# EAGLE design CN-Cape006-via08 (EAGLE 7.5.0)

## Sheet 1 of 5: Spannungsversorgung
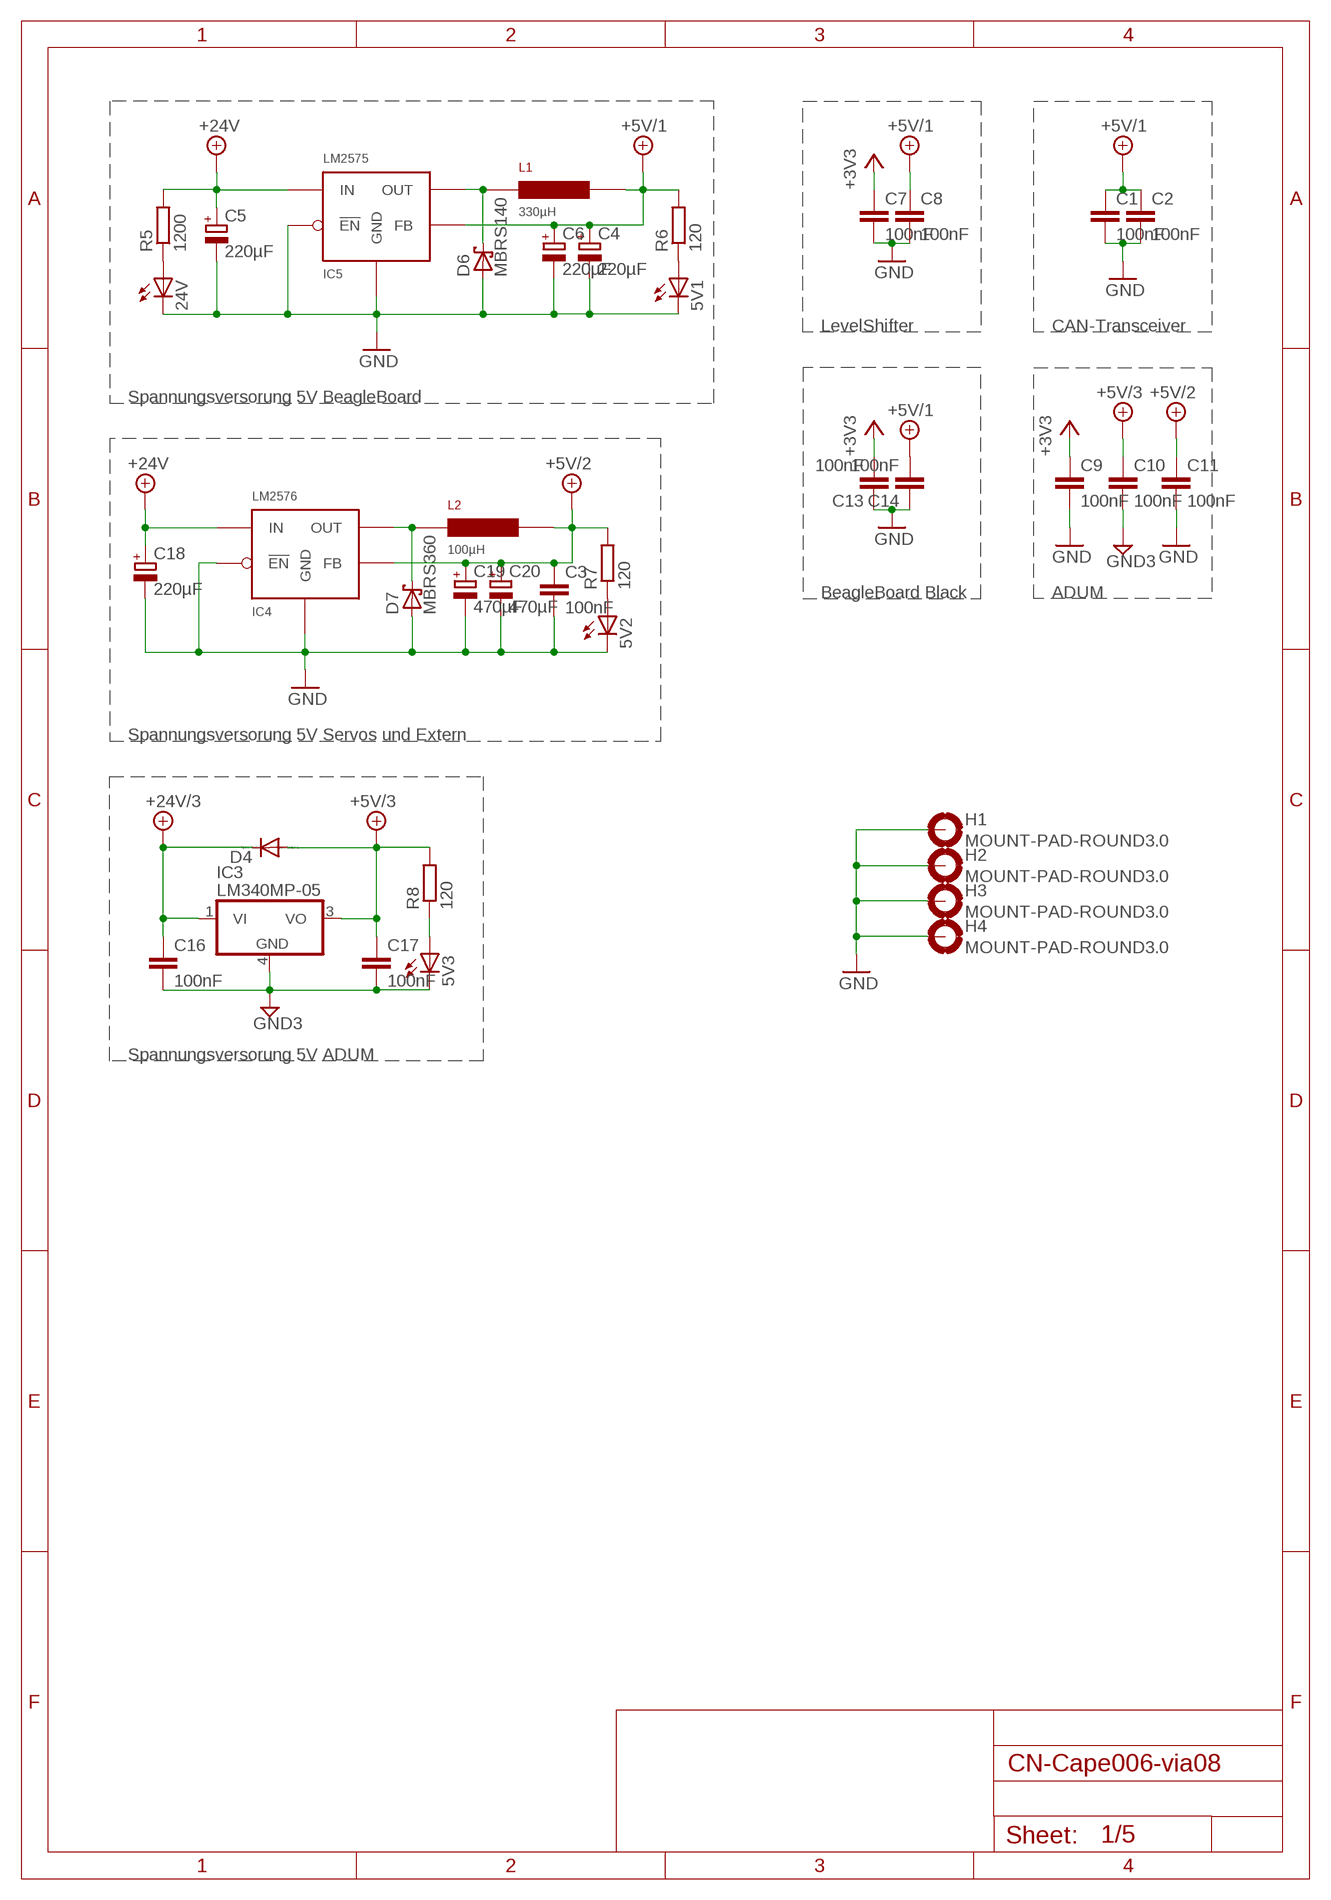
[diagram p0: schematic, sheet 1]

### Parts
5V1  LEDCHIP-LED0603  [CHIP-LED0603]
5V2  LEDCHIP-LED0603  [CHIP-LED0603]
5V3  LEDCHIP-LED0603  [CHIP-LED0603]
24V  LEDCHIP-LED0603  [CHIP-LED0603]
C1  100nF  C-EUC0603  [C0603]
C2  100nF  C-EUC0603  [C0603]
C3  100nF  C-EUC0603  [C0603]
C4  220µF  CPOL-EUE2.5-6  [E2,5-6]
C5  220µF  CPOL-EUE3.5-8  [E3,5-8]
C6  220µF  CPOL-EUE2.5-6  [E2,5-6]
C7  100nF  C-EUC0603  [C0603]
C8  100nF  C-EUC0603  [C0603]
C9  100nF  C-EUC0603  [C0603]
C10  100nF  C-EUC0603  [C0603]
C11  100nF  C-EUC0603  [C0603]
C13  100nF  C-EUC0603  [C0603]
C14  100nF  C-EUC0603  [C0603]
C16  100nF  C-EUC0603  [C0603]
C17  100nF  C-EUC0603  [C0603]
C18  220µF  CPOL-EUE3.5-8  [E3,5-8]
C19  470µF  CPOL-EUE3.5-8  [E3,5-8]
C20  470µF  CPOL-EUE3.5-8  [E3,5-8]
D4  DIODE-SOD123  [SOD123]
D6  MBRS140  MBRS130LT3  [SMB]
D7  MBRS360  MBRS340T3  [SMC]
H1  MOUNT-PAD-ROUND3.0  [3,0-PAD]
H2  MOUNT-PAD-ROUND3.0  [3,0-PAD]
H3  MOUNT-PAD-ROUND3.0  [3,0-PAD]
H4  MOUNT-PAD-ROUND3.0  [3,0-PAD]
IC3  LM340MP-05  [SOT223]
IC4  LM2576  LM2576-T05D  [TO220-5_STAGGERED]
IC5  LM2575  LM2576-T05D  [TO220-5_STAGGERED]
L1  330µH  PISR  [PISR]
L2  100µH  PISR  [PISR]
R5  1200  R-EU_R0805  [R0805]
R6  120  R-EU_R0805  [R0805]
R7  120  R-EU_R0805  [R0805]
R8  120  R-EU_R0805  [R0805]

### Nets
+3V3: C7.1 C9.1 C13.2 ; also sheet 2,3,4,5
+5V/1: C1.1 C2.1 C4.+ C6.+ C8.1 C14.2 IC5.FB L1.P$2 R6.2 ; also sheet 2,3,4
+5V/2: C3.1 C11.1 C19.+ C20.+ IC4.FB L2.P$2 R7.2 ; also sheet 4,5
+5V/3: C10.1 C17.1 D4.A IC3.3(VO) R8.2 ; also sheet 5
+24V: C5.+ C18.+ IC4.IN IC5.IN R5.2 ; also sheet 4
+24V/3: C16.1 D4.C IC3.1(VI) ; also sheet 5
GND: 5V1.C 5V2.C 24V.C C1.2 C2.2 C3.2 C4.- C5.- C6.- C7.2 C8.2 C9.2 C11.2 C13.1 C14.1 C18.- C19.- C20.- D6.A D7.A H1.B3,0(MOUNT) H2.B3,0(MOUNT) H3.B3,0(MOUNT) H4.B3,0(MOUNT) IC4.!EN IC4.GND IC5.!EN IC5.GND ; also sheet 2,3,4,5
GND3: 5V3.C C10.2 C16.2 C17.2 IC3.4(GND) ; also sheet 5
N$6: 24V.A R5.1
N$7: 5V1.A R6.1
N$8: 5V2.A R7.1
N$11: D6.C IC5.OUT L1.P$1
N$12: D7.C IC4.OUT L2.P$1
N$15: 5V3.A R8.1

### Notes on the sheet
- LevelShifter | CAN-Transceiver
- Spannungsversorung 5V BeagleBoard
- BeagleBoard Black | ADUM
- Spannungsversorung 5V Servos und Extern
- Spannungsversorung 5V ADUM

## Sheet 2 of 5: LevelShifter, CAN, LEDs, ADC
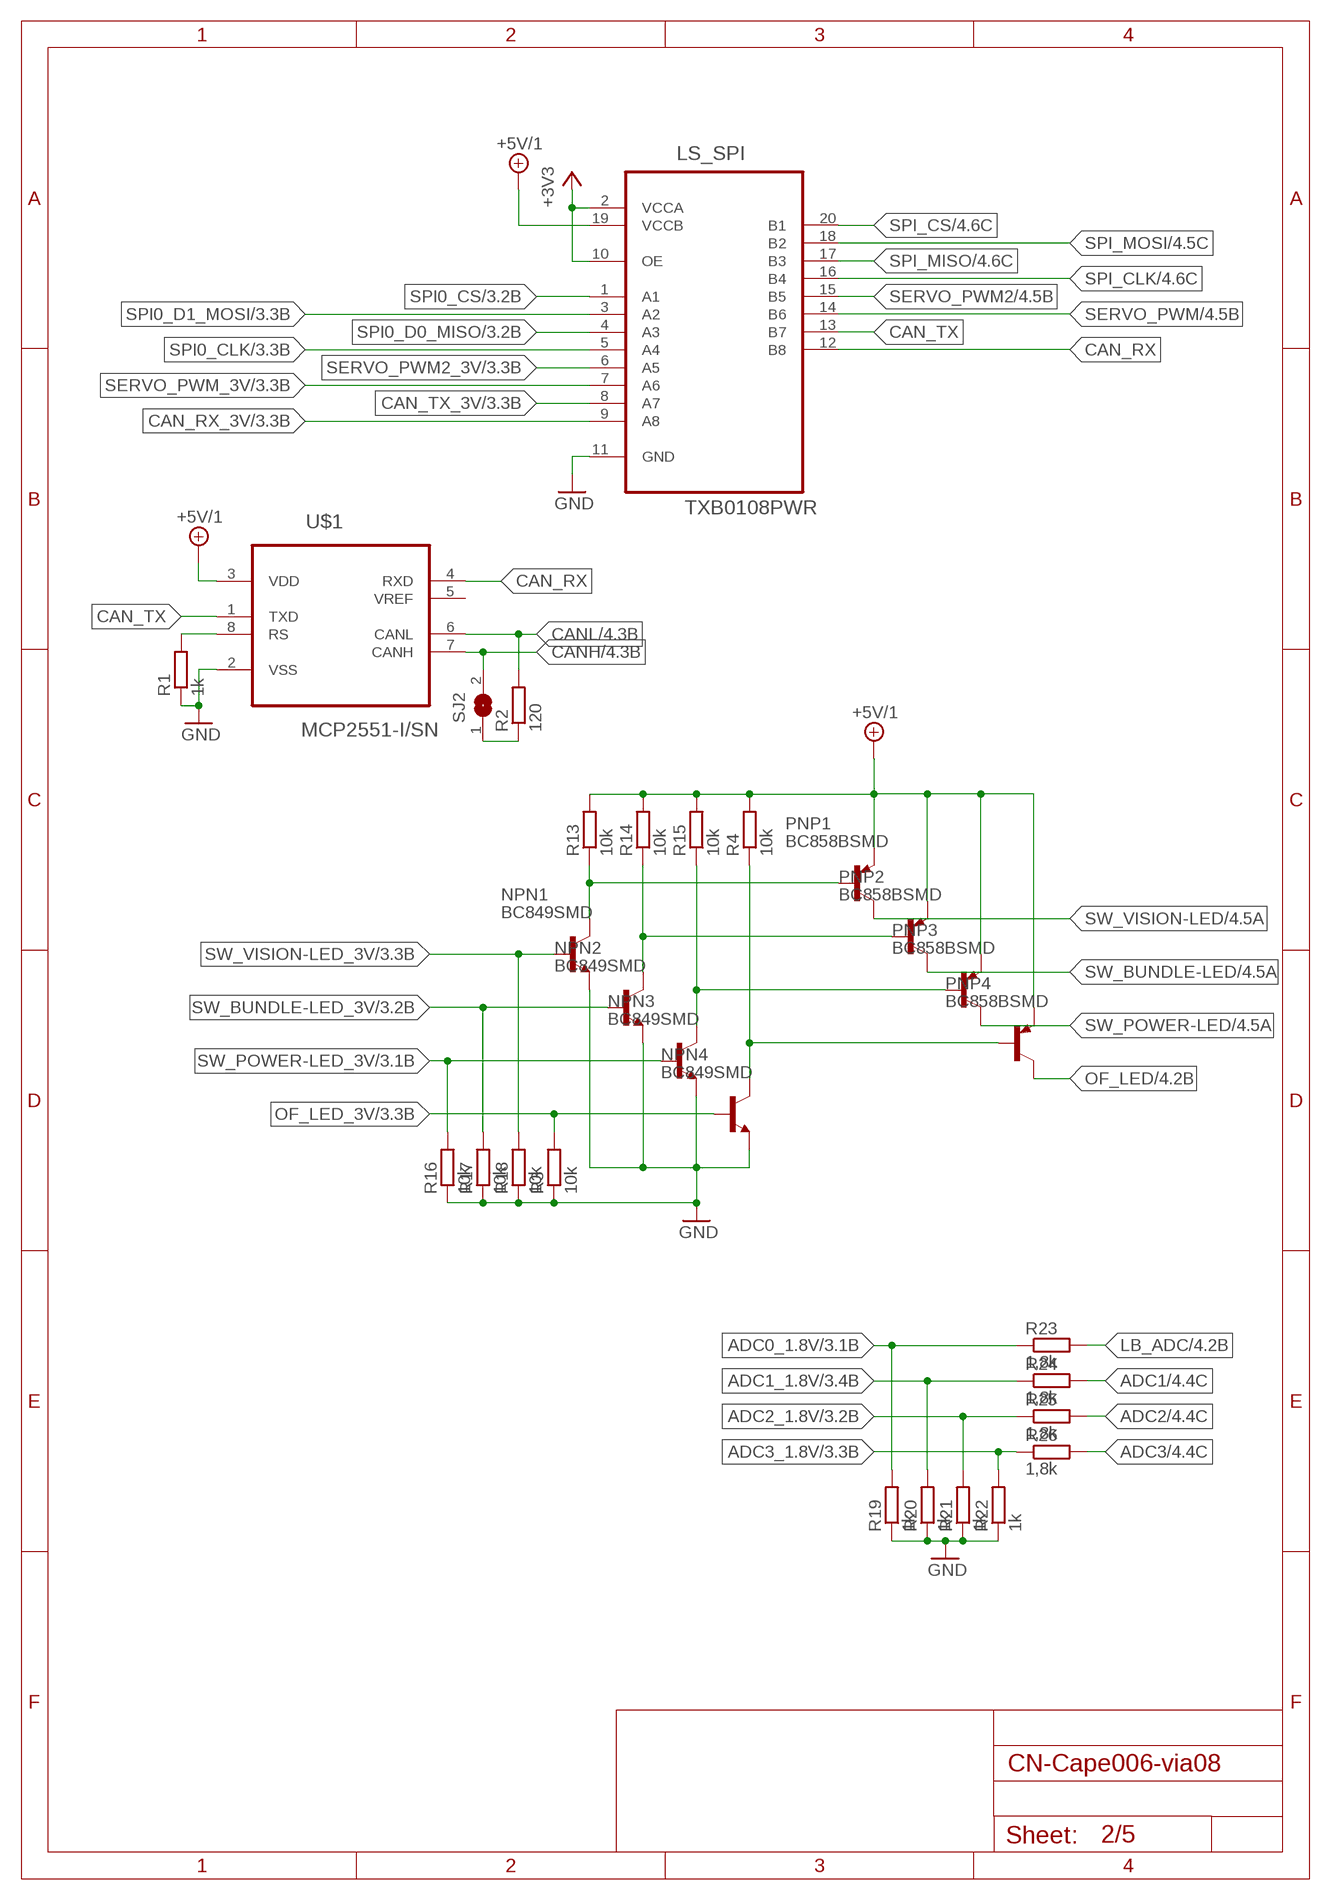
[diagram p1: schematic, sheet 2]

### Parts
LS_SPI  TXB0108PWR  [SOP65P640X120-20N]
NPN1  BC849SMD  [SOT23-BEC]
NPN2  BC849SMD  [SOT23-BEC]
NPN3  BC849SMD  [SOT23-BEC]
NPN4  BC849SMD  [SOT23-BEC]
PNP1  BC858BSMD  [SOT23-BEC]
PNP2  BC858BSMD  [SOT23-BEC]
PNP3  BC858BSMD  [SOT23-BEC]
PNP4  BC858BSMD  [SOT23-BEC]
R1  1k  R-EU_R0805  [R0805]
R2  120  R-EU_R0805  [R0805]
R3  10k  R-EU_R0805  [R0805]
R4  10k  R-EU_R0805  [R0805]
R13  10k  R-EU_R0805  [R0805]
R14  10k  R-EU_R0805  [R0805]
R15  10k  R-EU_R0805  [R0805]
R16  10k  R-EU_R0805  [R0805]
R17  10k  R-EU_R0805  [R0805]
R18  10k  R-EU_R0805  [R0805]
R19  1k  R-EU_R0805  [R0805]
R20  1k  R-EU_R0805  [R0805]
R21  1k  R-EU_R0805  [R0805]
R22  1k  R-EU_R0805  [R0805]
R23  1,8k  R-EU_R0805  [R0805]
R24  1,8k  R-EU_R0805  [R0805]
R25  1,8k  R-EU_R0805  [R0805]
R26  1,8k  R-EU_R0805  [R0805]
SJ2  SJ  [SJ]
U$1  MCP2551-I/SN  [SOIC127P600X175-8N]

### Nets
+3V3: LS_SPI.2(VCCA) LS_SPI.10(OE) ; also sheet 1,3,4,5
+5V/1: LS_SPI.19(VCCB) PNP1.E PNP2.E PNP3.E PNP4.E R4.2 R13.2 R14.2 R15.2 U$1.3(VDD) ; also sheet 1,3,4
ADC0_1.8V: R19.2 R23.1 ; also sheet 3
ADC1: R24.2 ; also sheet 4
ADC1_1.8V: R20.2 R24.1 ; also sheet 3
ADC2: R25.2 ; also sheet 4
ADC2_1.8V: R21.2 R25.1 ; also sheet 3
ADC3: R26.2 ; also sheet 4
ADC3_1.8V: R22.2 R26.1 ; also sheet 3
CAN_RX: LS_SPI.12(B8) U$1.4(RXD)
CAN_RX_3V: LS_SPI.9(A8) ; also sheet 3
CAN_TX: LS_SPI.13(B7) U$1.1(TXD)
CAN_TX_3V: LS_SPI.8(A7) ; also sheet 3
CANH: SJ2.2 U$1.7(CANH) ; also sheet 4
CANL: R2.2 U$1.6(CANL) ; also sheet 4
GND: LS_SPI.11(GND) NPN1.E NPN2.E NPN3.E NPN4.E R1.1 R3.1 R16.1 R17.1 R18.1 R19.1 R20.1 R21.1 R22.1 U$1.2(VSS) ; also sheet 1,3,4,5
LB_ADC: R23.2 ; also sheet 4
N$1: NPN1.C PNP1.B R13.1
N$2: NPN2.C PNP2.B R14.1
N$3: NPN4.C PNP4.B R4.1
N$4: NPN3.C PNP3.B R15.1
N$9: R1.2 U$1.8(RS)
N$10: R2.1 SJ2.1
OF_LED: PNP4.C ; also sheet 4
OF_LED_3V: NPN4.B R3.2 ; also sheet 3
SERVO_PWM: LS_SPI.14(B6) ; also sheet 4
SERVO_PWM2: LS_SPI.15(B5) ; also sheet 4
SERVO_PWM2_3V: LS_SPI.6(A5) ; also sheet 3
SERVO_PWM_3V: LS_SPI.7(A6) ; also sheet 3
SPI0_CLK: LS_SPI.5(A4) ; also sheet 3,4
SPI0_CS: LS_SPI.1(A1) ; also sheet 3
SPI0_D0_MISO: LS_SPI.4(A3) ; also sheet 3,4
SPI0_D1_MOSI: LS_SPI.3(A2) ; also sheet 3,4
SPI_CLK: LS_SPI.16(B4) ; also sheet 4
SPI_CS: LS_SPI.20(B1) ; also sheet 4
SPI_MISO: LS_SPI.17(B3) ; also sheet 4
SPI_MOSI: LS_SPI.18(B2) ; also sheet 4
SW_BUNDLE-LED: PNP2.C ; also sheet 4
SW_BUNDLE-LED_3V: NPN2.B R17.2 ; also sheet 3
SW_POWER-LED: PNP3.C ; also sheet 4
SW_POWER-LED_3V: NPN3.B R16.2 ; also sheet 3
SW_VISION-LED: PNP1.C ; also sheet 4
SW_VISION-LED_3V: NPN1.B R18.2 ; also sheet 3
Unconnected: U$1.5(VREF)

## Sheet 3 of 5: Stecker BeagleBoard Black
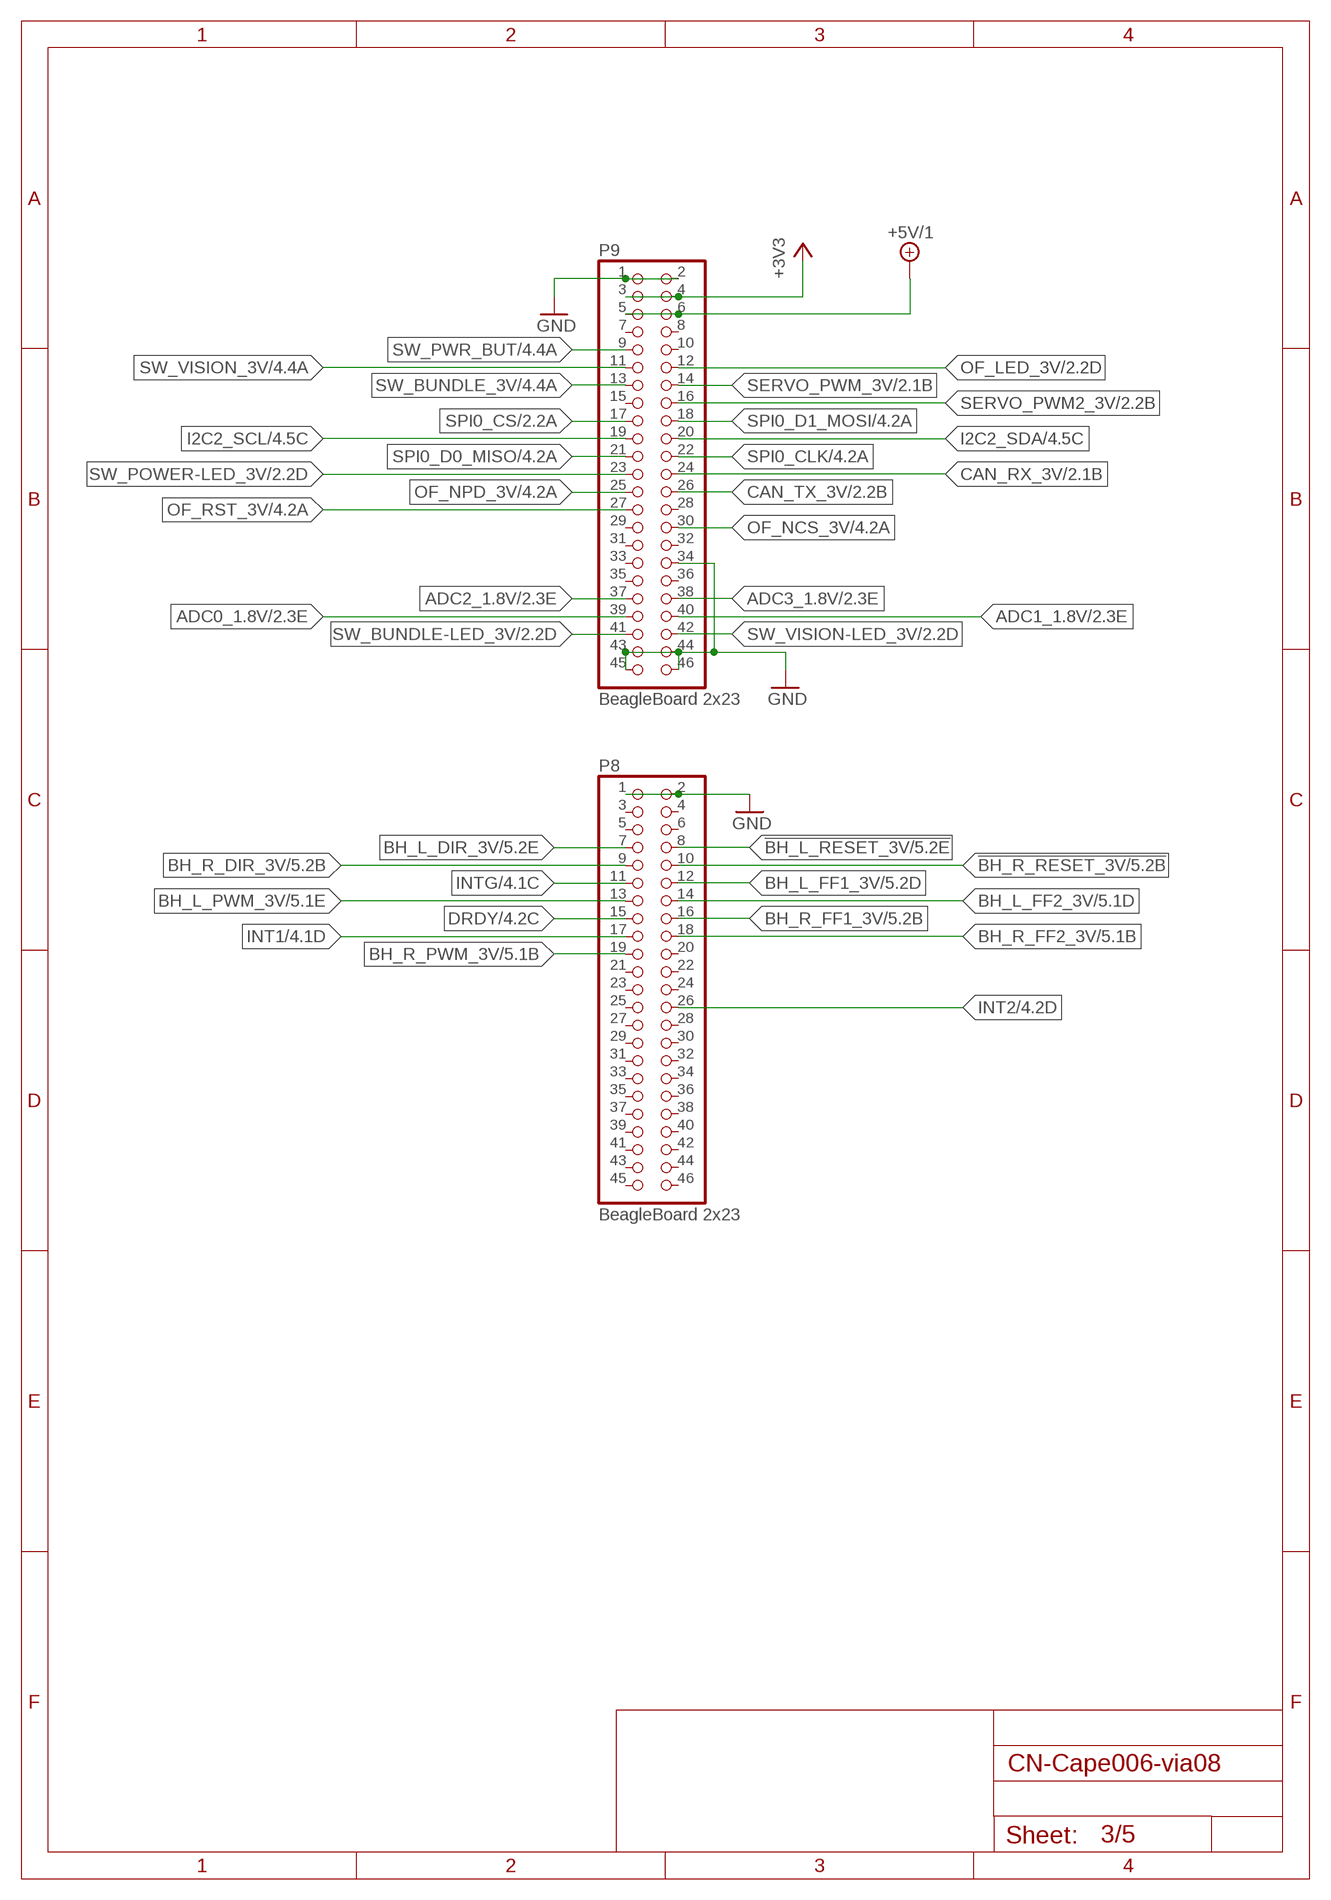
[diagram p2: schematic, sheet 3]

### Parts
P8  BeagleBoard 2x23  PINHD-2X23  [2X23]
P9  BeagleBoard 2x23  PINHD-2X23  [2X23]

### Nets
!BH_L_RESET_3V: P8.8 ; also sheet 5
!BH_R_RESET_3V: P8.10 ; also sheet 5
+3V3: P9.3 P9.4 ; also sheet 1,2,4,5
+5V/1: P9.5 P9.6 ; also sheet 1,2,4
ADC0_1.8V: P9.39 ; also sheet 2
ADC1_1.8V: P9.40 ; also sheet 2
ADC2_1.8V: P9.37 ; also sheet 2
ADC3_1.8V: P9.38 ; also sheet 2
BH_L_DIR_3V: P8.7 ; also sheet 5
BH_L_FF1_3V: P8.12 ; also sheet 5
BH_L_FF2_3V: P8.14 ; also sheet 5
BH_L_PWM_3V: P8.13 ; also sheet 5
BH_R_DIR_3V: P8.9 ; also sheet 5
BH_R_FF1_3V: P8.16 ; also sheet 5
BH_R_FF2_3V: P8.18 ; also sheet 5
BH_R_PWM_3V: P8.19 ; also sheet 5
CAN_RX_3V: P9.24 ; also sheet 2
CAN_TX_3V: P9.26 ; also sheet 2
DRDY: P8.15 ; also sheet 4
GND: P8.1 P8.2 P9.1 P9.2 P9.34 P9.43 P9.44 P9.45 P9.46 ; also sheet 1,2,4,5
I2C2_SCL: P9.19 ; also sheet 4
I2C2_SDA: P9.20 ; also sheet 4
INT1: P8.17 ; also sheet 4
INT2: P8.26 ; also sheet 4
INTG: P8.11 ; also sheet 4
OF_LED_3V: P9.12 ; also sheet 2
OF_NCS_3V: P9.30 ; also sheet 4
OF_NPD_3V: P9.25 ; also sheet 4
OF_RST_3V: P9.27 ; also sheet 4
SERVO_PWM2_3V: P9.16 ; also sheet 2
SERVO_PWM_3V: P9.14 ; also sheet 2
SPI0_CLK: P9.22 ; also sheet 2,4
SPI0_CS: P9.17 ; also sheet 2
SPI0_D0_MISO: P9.21 ; also sheet 2,4
SPI0_D1_MOSI: P9.18 ; also sheet 2,4
SW_BUNDLE-LED_3V: P9.41 ; also sheet 2
SW_BUNDLE_3V: P9.13 ; also sheet 4
SW_POWER-LED_3V: P9.23 ; also sheet 2
SW_PWR_BUT: P9.9 ; also sheet 4
SW_VISION-LED_3V: P9.42 ; also sheet 2
SW_VISION_3V: P9.11 ; also sheet 4
Unconnected: P8.3 P8.4 P8.5 P8.6 P8.20 P8.21 P8.22 P8.23 P8.24 P8.25 P8.27 P8.28 P8.29 P8.30 P8.31 P8.32 P8.33 P8.34 P8.35 P8.36 P8.37 P8.38 P8.39 P8.40 P8.41 P8.42 P8.43 P8.44 P8.45 P8.46 P9.7 P9.8 P9.10 P9.15 P9.28 P9.29 P9.31 P9.32 P9.33 P9.35 P9.36

## Sheet 4 of 5: Stecker
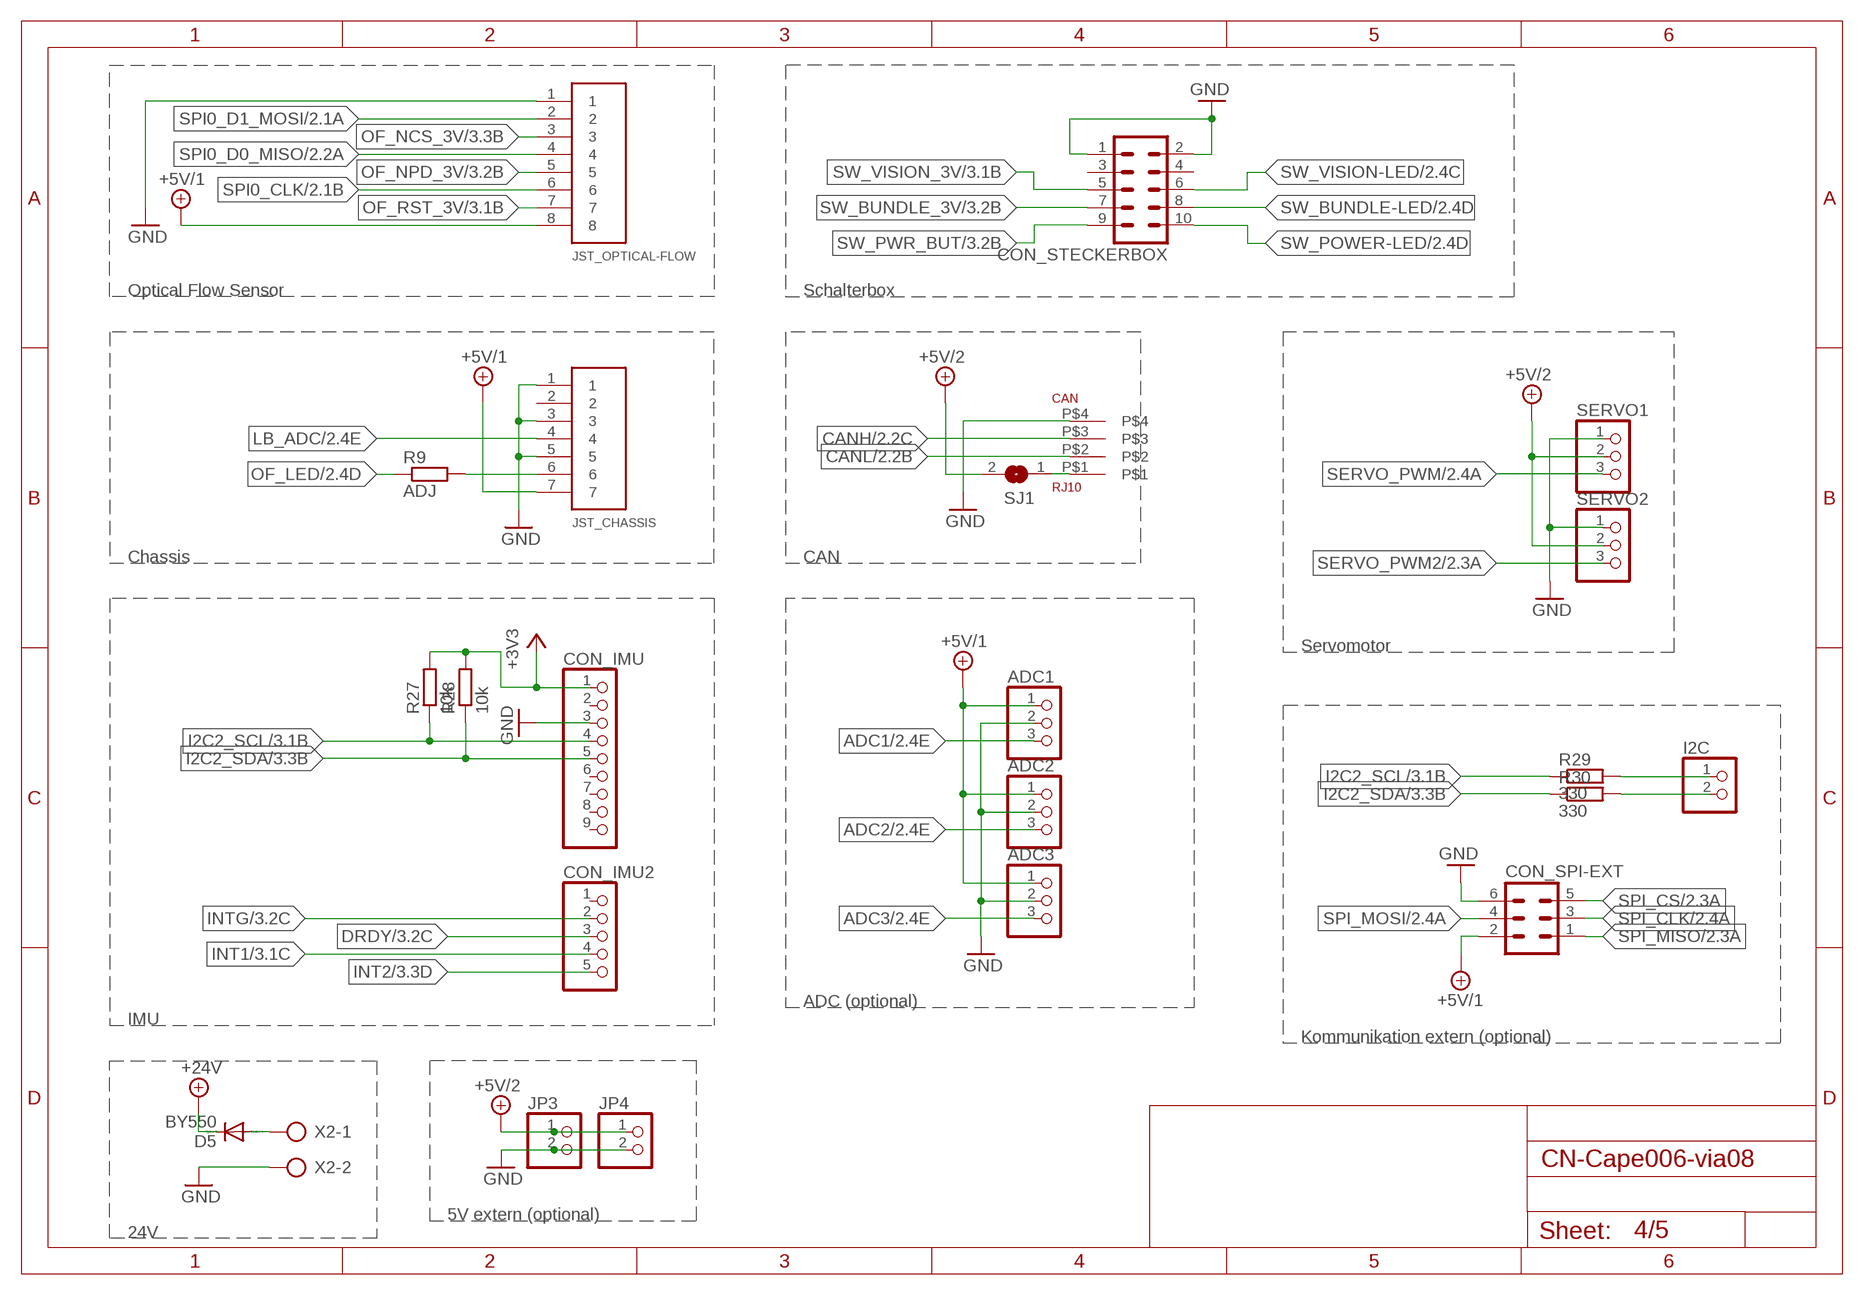
[diagram p3: schematic, sheet 4]

### Parts
ADC1  PINHD-1X3  [1X03]
ADC2  PINHD-1X3  [1X03]
ADC3  PINHD-1X3  [1X03]
CAN  RJ10  [RJ10]
CON_IMU  PINHD-1X9  [1X09]
CON_IMU2  PINHD-1X5  [1X05]
CON_SPI-EXT  ML6  [ML6]
CON_STECKERBOX  ML10  [ML10]
D5  BY550  [DO27-15]
I2C  PINHD-1X2  [1X02]
JP3  PINHD-1X2  [1X02]
JP4  PINHD-1X2  [1X02]
JST_CHASSIS  S7PIN  [S7B-EH]
JST_OPTICAL-FLOW  S8PIN  [S8B-EH]
R9  ADJ  R-EU_R0805  [R0805]
R27  10k  R-EU_R0805  [R0805]
R28  10k  R-EU_R0805  [R0805]
R29  330  R-EU_R0805  [R0805]
R30  330  R-EU_R0805  [R0805]
SERVO1  PINHD-1X3  [1X03]
SERVO2  PINHD-1X3  [1X03]
SJ1  SJ  [SJ]
X2  AK500/2-H  [AK500/2-H]

### Nets
+3V3: CON_IMU.1 R27.2 R28.2 ; also sheet 1,2,3,5
+5V/1: ADC1.1 ADC2.1 ADC3.1 CON_SPI-EXT.2 JST_CHASSIS.7 JST_OPTICAL-FLOW.8 ; also sheet 1,2,3
+5V/2: JP3.1 JP4.1 SERVO1.2 SERVO2.2 SJ1.2 ; also sheet 1,5
+24V: D5.C ; also sheet 1
ADC1: ADC1.3 ; also sheet 2
ADC2: ADC2.3 ; also sheet 2
ADC3: ADC3.3 ; also sheet 2
CANH: CAN.P$3 ; also sheet 2
CANL: CAN.P$2 ; also sheet 2
DRDY: CON_IMU2.3 ; also sheet 3
GND: ADC1.2 ADC2.2 ADC3.2 CAN.P$4 CON_IMU.3 CON_SPI-EXT.6 CON_STECKERBOX.1 CON_STECKERBOX.2 JP3.2 JP4.2 JST_CHASSIS.1 JST_CHASSIS.3 JST_CHASSIS.5 JST_OPTICAL-FLOW.1 SERVO1.1 SERVO2.1 X2.2 ; also sheet 1,2,3,5
I2C2_SCL: CON_IMU.4 R27.1 R29.1 ; also sheet 3
I2C2_SDA: CON_IMU.5 R28.1 R30.1 ; also sheet 3
INT1: CON_IMU2.4 ; also sheet 3
INT2: CON_IMU2.5 ; also sheet 3
INTG: CON_IMU2.2 ; also sheet 3
LB_ADC: JST_CHASSIS.4 ; also sheet 2
N$5: D5.A X2.1
N$16: JST_CHASSIS.6 R9.2
N$17: I2C.1 R29.2
N$18: I2C.2 R30.2
N$19: CAN.P$1 SJ1.1
OF_LED: R9.1 ; also sheet 2
OF_NCS_3V: JST_OPTICAL-FLOW.3 ; also sheet 3
OF_NPD_3V: JST_OPTICAL-FLOW.5 ; also sheet 3
OF_RST_3V: JST_OPTICAL-FLOW.7 ; also sheet 3
SERVO_PWM: SERVO1.3 ; also sheet 2
SERVO_PWM2: SERVO2.3 ; also sheet 2
SPI0_CLK: JST_OPTICAL-FLOW.6 ; also sheet 2,3
SPI0_D0_MISO: JST_OPTICAL-FLOW.4 ; also sheet 2,3
SPI0_D1_MOSI: JST_OPTICAL-FLOW.2 ; also sheet 2,3
SPI_CLK: CON_SPI-EXT.3 ; also sheet 2
SPI_CS: CON_SPI-EXT.5 ; also sheet 2
SPI_MISO: CON_SPI-EXT.1 ; also sheet 2
SPI_MOSI: CON_SPI-EXT.4 ; also sheet 2
SW_BUNDLE-LED: CON_STECKERBOX.8 ; also sheet 2
SW_BUNDLE_3V: CON_STECKERBOX.7 ; also sheet 3
SW_POWER-LED: CON_STECKERBOX.10 ; also sheet 2
SW_PWR_BUT: CON_STECKERBOX.9 ; also sheet 3
SW_VISION-LED: CON_STECKERBOX.6 ; also sheet 2
SW_VISION_3V: CON_STECKERBOX.5 ; also sheet 3
Unconnected: CON_IMU2.1 CON_IMU.2 CON_IMU.6 CON_IMU.7 CON_IMU.8 CON_IMU.9 CON_STECKERBOX.3 CON_STECKERBOX.4 JST_CHASSIS.2

### Notes on the sheet
- Optical Flow Sensor | Schalterbox
- Chassis | CAN
- Servomotor
- ADC (optional)
- IMU
- Kommunikation extern (optional)
- 5V extern (optional)
- 24V

## Sheet 5 of 5: Ballführung
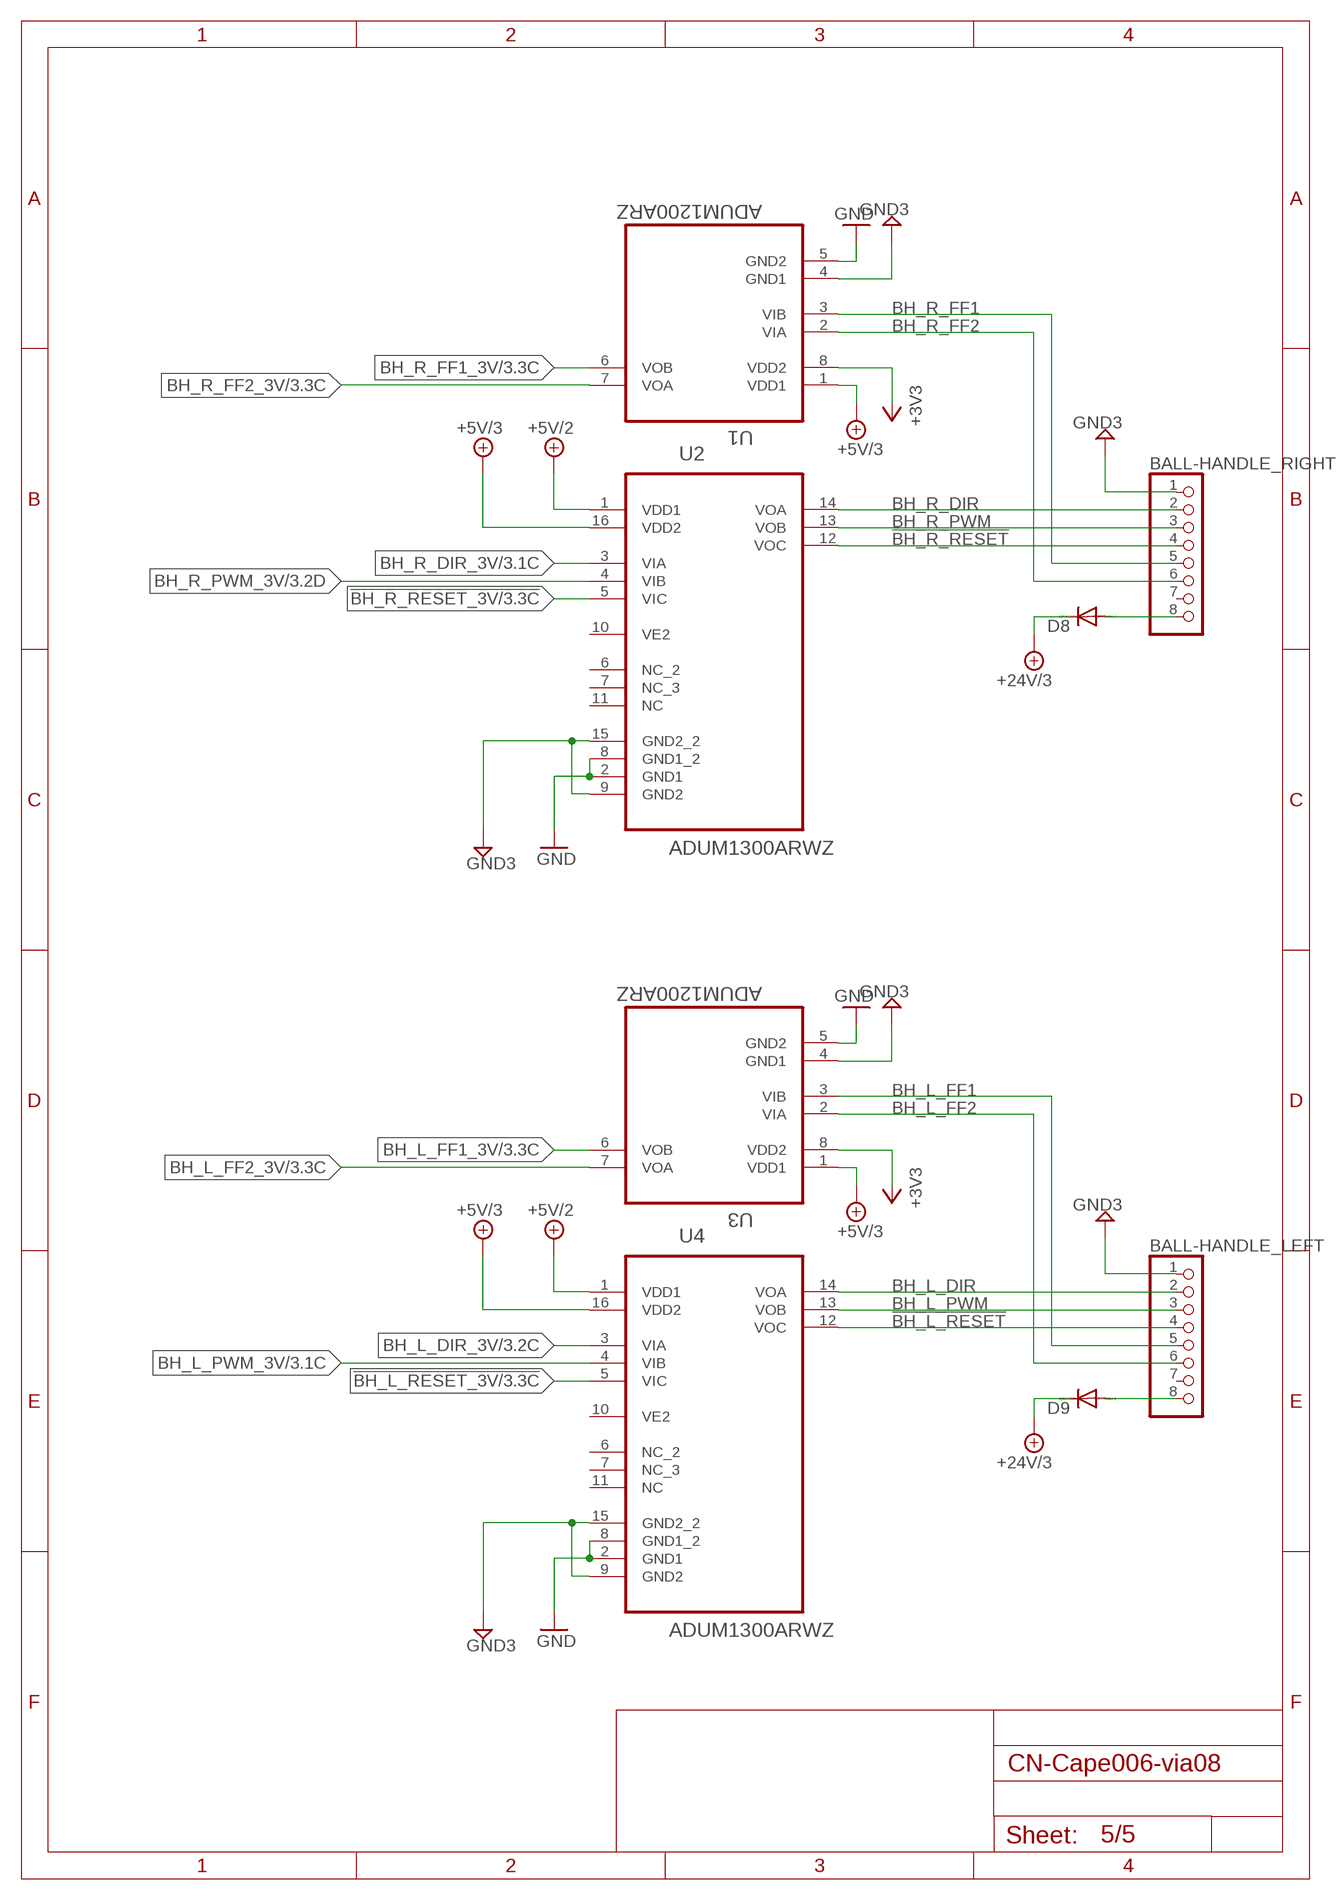
[diagram p4: schematic, sheet 5]

### Parts
BALL-HANDLE_LEFT  PINHD-1X8  [1X08]
BALL-HANDLE_RIGHT  PINHD-1X8  [1X08]
D8  DIODE-SOD123  [SOD123]
D9  DIODE-SOD123  [SOD123]
U1  ADUM1200ARZ  [SOIC127P600X175-8N]
U2  ADUM1300ARWZ  [SOIC127P1032X265-16N]
U3  ADUM1200ARZ  [SOIC127P600X175-8N]
U4  ADUM1300ARWZ  [SOIC127P1032X265-16N]

### Nets
!BH_L_RESET: BALL-HANDLE_LEFT.4 U4.12(VOC)
!BH_L_RESET_3V: U4.5(VIC) ; also sheet 3
!BH_R_RESET: BALL-HANDLE_RIGHT.4 U2.12(VOC)
!BH_R_RESET_3V: U2.5(VIC) ; also sheet 3
+3V3: U1.8(VDD2) U3.8(VDD2) ; also sheet 1,2,3,4
+5V/2: U2.1(VDD1) U4.1(VDD1) ; also sheet 1,4
+5V/3: U1.1(VDD1) U2.16(VDD2) U3.1(VDD1) U4.16(VDD2) ; also sheet 1
+24V/3: D8.C D9.C ; also sheet 1
BH_L_DIR: BALL-HANDLE_LEFT.2 U4.14(VOA)
BH_L_DIR_3V: U4.3(VIA) ; also sheet 3
BH_L_FF1: BALL-HANDLE_LEFT.5 U3.3(VIB)
BH_L_FF1_3V: U3.6(VOB) ; also sheet 3
BH_L_FF2: BALL-HANDLE_LEFT.6 U3.2(VIA)
BH_L_FF2_3V: U3.7(VOA) ; also sheet 3
BH_L_PWM: BALL-HANDLE_LEFT.3 U4.13(VOB)
BH_L_PWM_3V: U4.4(VIB) ; also sheet 3
BH_R_DIR: BALL-HANDLE_RIGHT.2 U2.14(VOA)
BH_R_DIR_3V: U2.3(VIA) ; also sheet 3
BH_R_FF1: BALL-HANDLE_RIGHT.5 U1.3(VIB)
BH_R_FF1_3V: U1.6(VOB) ; also sheet 3
BH_R_FF2: BALL-HANDLE_RIGHT.6 U1.2(VIA)
BH_R_FF2_3V: U1.7(VOA) ; also sheet 3
BH_R_PWM: BALL-HANDLE_RIGHT.3 U2.13(VOB)
BH_R_PWM_3V: U2.4(VIB) ; also sheet 3
GND: U1.5(GND2) U2.2(GND1) U2.8(GND1_2) U3.5(GND2) U4.2(GND1) U4.8(GND1_2) ; also sheet 1,2,3,4
GND3: BALL-HANDLE_LEFT.1 BALL-HANDLE_RIGHT.1 U1.4(GND1) U2.9(GND2) U2.15(GND2_2) U3.4(GND1) U4.9(GND2) U4.15(GND2_2) ; also sheet 1
N$13: BALL-HANDLE_LEFT.8 D9.A
N$14: BALL-HANDLE_RIGHT.8 D8.A
Unconnected: BALL-HANDLE_LEFT.7 BALL-HANDLE_RIGHT.7 U2.6(NC_2) U2.7(NC_3) U2.10(VE2) U2.11(NC) U4.6(NC_2) U4.7(NC_3) U4.10(VE2) U4.11(NC)

## Library data of the parts
5V1-5V3 24V = led:LED: LED OSRAM: - CHIPLED LG R971, LG N971, LY N971, LG Q971, LY Q971, LO R971, LY R971 LH N974, LH R974 LS Q976, LO Q976, LY Q976 LO Q996 - Hyper CHIPLED LW Q18S LB Q993, LB Q99A, LB R99A - SideLED LS A670, LO A670, LY A670, LG A670, LP A670 LB A673, LV A673, LT A673, LW A673 LH A674 LY A675 LS A676, LA A676, LO A676, LY A676, LW A676 LS A679, LY A679, LG A679 - Hyper Micro SIDELED® LS Y876, LA Y876, LO Y876, LY Y876 LT Y87S - SmartLED LW L88C, LW L88S LB L89C, LB L89S, LG L890 LS L89K, LO L89K, LY L89K LS L896, LA L896, LO L896, LY L896 - TOPLED LS T670, LO T670, LY T670, LG T670, LP T670 LSG T670, LSP T670, LSY T670, LOP T670, LYG T670 LG T671, LOG T671, LSG T671 LB T673, LV T673, LT T673, LW T673 LH T674 LS T676, LA T676, LO T676, LY T676, LB T676, LH T676, LSB T676, LW T676 LB T67C, LV T67C, LT T67C, LS T67K, LO T67K, LY T67K, LW E67C LS E67B, LA E67B, LO E67B, LY E67B, LB E67C, LV E67C, LT E67C LW T67C LS T679, LY T679, LG T679 LS T770, LO T770, LY T770, LG T770, LP T770 LB T773, LV T773, LT T773, LW T773 LH T774 LS E675, LA E675, LY E675, LS T675 LS T776, LA T776, LO T776, LY T776, LB T776 LHGB T686 LT T68C, LB T68C - Hyper Mini TOPLED® LB M676 - Mini TOPLED Santana® LG M470 LS M47K, LO M47K, LY M47K Source: http://www.osram.convergy.de LUXEON: - LUMILED® LXK2-PW12-R00, LXK2-PW12-S00, LXK2-PW14-U00, LXK2-PW14-V00 LXK2-PM12-R00, LXK2-PM12-S00, LXK2-PM14-U00 LXK2-PE12-Q00, LXK2-PE12-R00, LXK2-PE12-S00, LXK2-PE14-T00, LXK2-PE14-U00 LXK2-PB12-K00, LXK2-PB12-L00, LXK2-PB12-M00, LXK2-PB14-N00, LXK2-PB14-P00, LXK2-PB14-Q00 LXK2-PR12-L00, LXK2-PR12-M00, LXK2-PR14-Q00, LXK2-PR14-R00 LXK2-PD12-Q00, LXK2-PD12-R00, LXK2-PD12-S00 LXK2-PH12-R00, LXK2-PH12-S00 LXK2-PL12-P00, LXK2-PL12-Q00, LXK2-PL12-R00 Source: www.luxeon.com KINGBRIGHT: KA-3528ASYC Source: www.kingbright.com
ADC1-ADC3 SERVO1 SERVO2 = pinhead:PINHD-1X3: PIN HEADER
BALL-HANDLE_LEFT BALL-HANDLE_RIGHT = pinhead:PINHD-1X8: PIN HEADER
C1-C3 C7-C11 C13 C14 C16 C17 = rcl:C-EU: CAPACITOR, European symbol
C4-C6 C18-C20 = rcl:CPOL-EU: POLARIZED CAPACITOR, European symbol
CAN = ownParts:RJ10
CON_IMU = pinhead:PINHD-1X9: PIN HEADER
CON_IMU2 = pinhead:PINHD-1X5: PIN HEADER
CON_SPI-EXT = con-ml:ML6: HARTING
CON_STECKERBOX = con-ml:ML10: HARTING
D4 D8 D9 = diode:DIODE-: DIODE; REICHELT: SD 101BW
D5 = diode:BY550: DIODE Si200 V, 5 A
D6 = diode:MBRS130LT3: Schottky Power Rectifier Source: http://www.onsemi.com/pub/Collateral/MBRS130LT3-D.PDF
D7 = diode:MBRS3*0T3: SCHOTTKY BARRIER RECTIFIER 3.0 AMPERES 20, 30, 40 VOLT Source: MBRS340T3-D.pdf
H1-H4 = holes:MOUNT-PAD-ROUND: MOUNTING PAD, round
I2C JP3 JP4 = pinhead:PINHD-1X2: PIN HEADER
IC3 = linear:LM340?-*: Positive VOLTAGE REGULATOR Source: http://cache.national.com/ds/LM/LM340.pdf
IC4 IC5 = to220-custom:LM2576-T05D: LM2576/LM2576HV Series SIMPLE SWITCHER® 3A Step-Down Voltage Regulator STAGGERED PACKAGE
JST_CHASSIS = jst_eh:S7PIN
JST_OPTICAL-FLOW = jst_eh:S8PIN
L1 L2 = inductor_FASTRON:PISR
LS_SPI = TI-TXB0108PWR:TXB0108PWR: 8-BIT BIDIRECTIONAL VOLTAGE-LEVEL TRANSLATOR; MPN: TXB0108PWR; OC_FARNELL: 1494945; OC_NEWARK: 27M1151; PACKAGE: TSSOP-20; SUPPLIER: Texas Instruments
NPN1-NPN4 = transistor-npn:BC849*: NPN Transistor
P8 P9 = pinhead-2x23:PINHD-2X23
PNP1-PNP4 = transistor-pnp:BC858*: PNP Transistror
R1-R9 R13-R30 = rcl:R-EU_: RESISTOR, European symbol
SJ1 SJ2 = jumper:SJ: SMD solder JUMPER
U1 U3 = ADUM1200:ADUM1200ARZ: Dual-Channel Digital Isolators; MPN: ADUM1200ARZ; OC_FARNELL: 1078204; OC_NEWARK: 19M0750; PACKAGE: SOIC-8; SUPPLIER: Analog Devices
U2 U4 = ADUM1300:ADUM1300ARWZ: Triple-Channel Digital Isolators; MPN: ADUM1300ARWZ; OC_FARNELL: 1226209; OC_NEWARK: 19M8751; PACKAGE: SOIC-16; SUPPLIER: Analog Devices
U$1 = Microchip-MCP2551-I_SN:MCP2551-I/SN: High-Speed CAN Transceiver; MPN: MCP2551-I/SN; OC_FARNELL: 9758569; OC_NEWARK: 69K7604; PACKAGE: SOIC-8; SUPPLIER: Microchip
X2 = con-ptr500:AK500/2-H: CONNECTOR Aug. 2004 / PTR Meßtechnik: Die Bezeichnung der Serie AK505 wurde geändert. Es handelt sich hierbei um AK500 in horizontaler Ausführung.

## Board
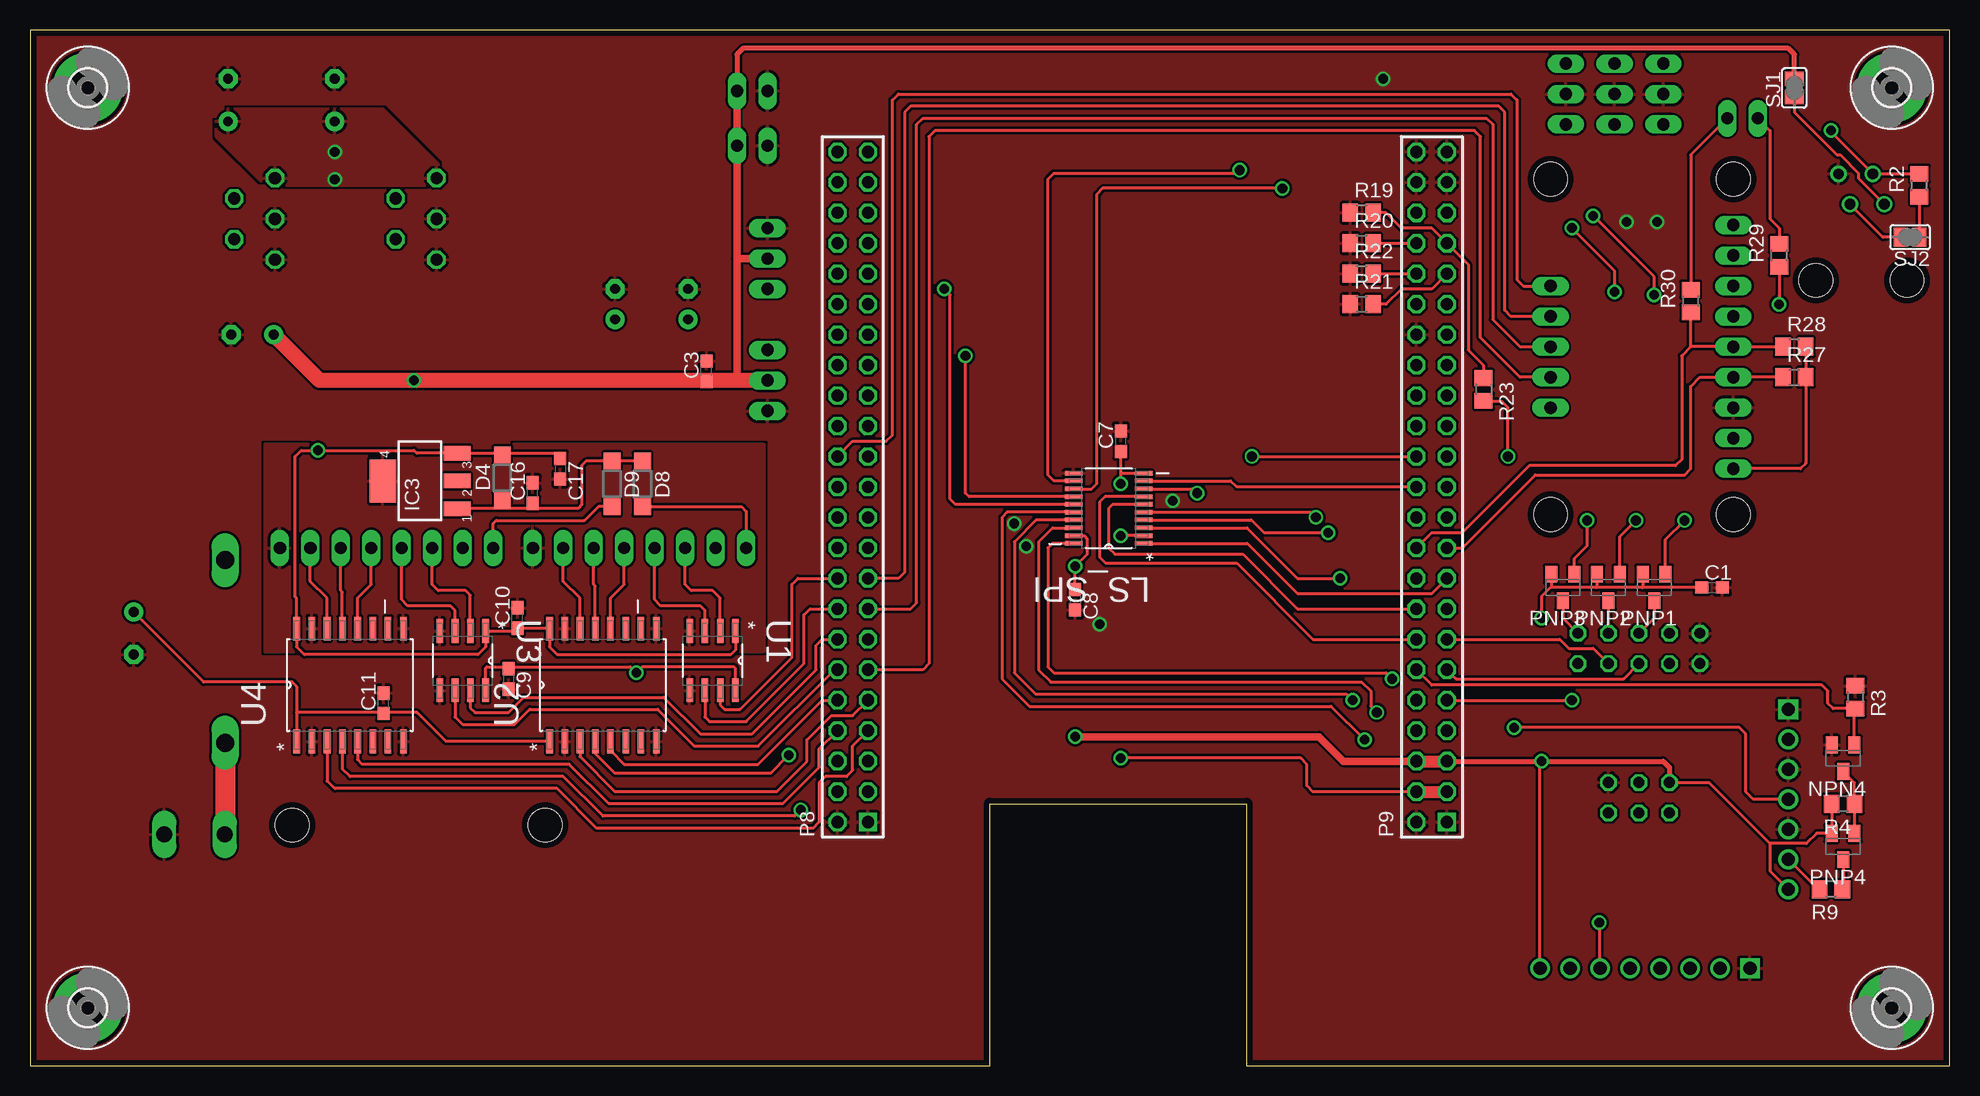
[diagram p5: board, top side]
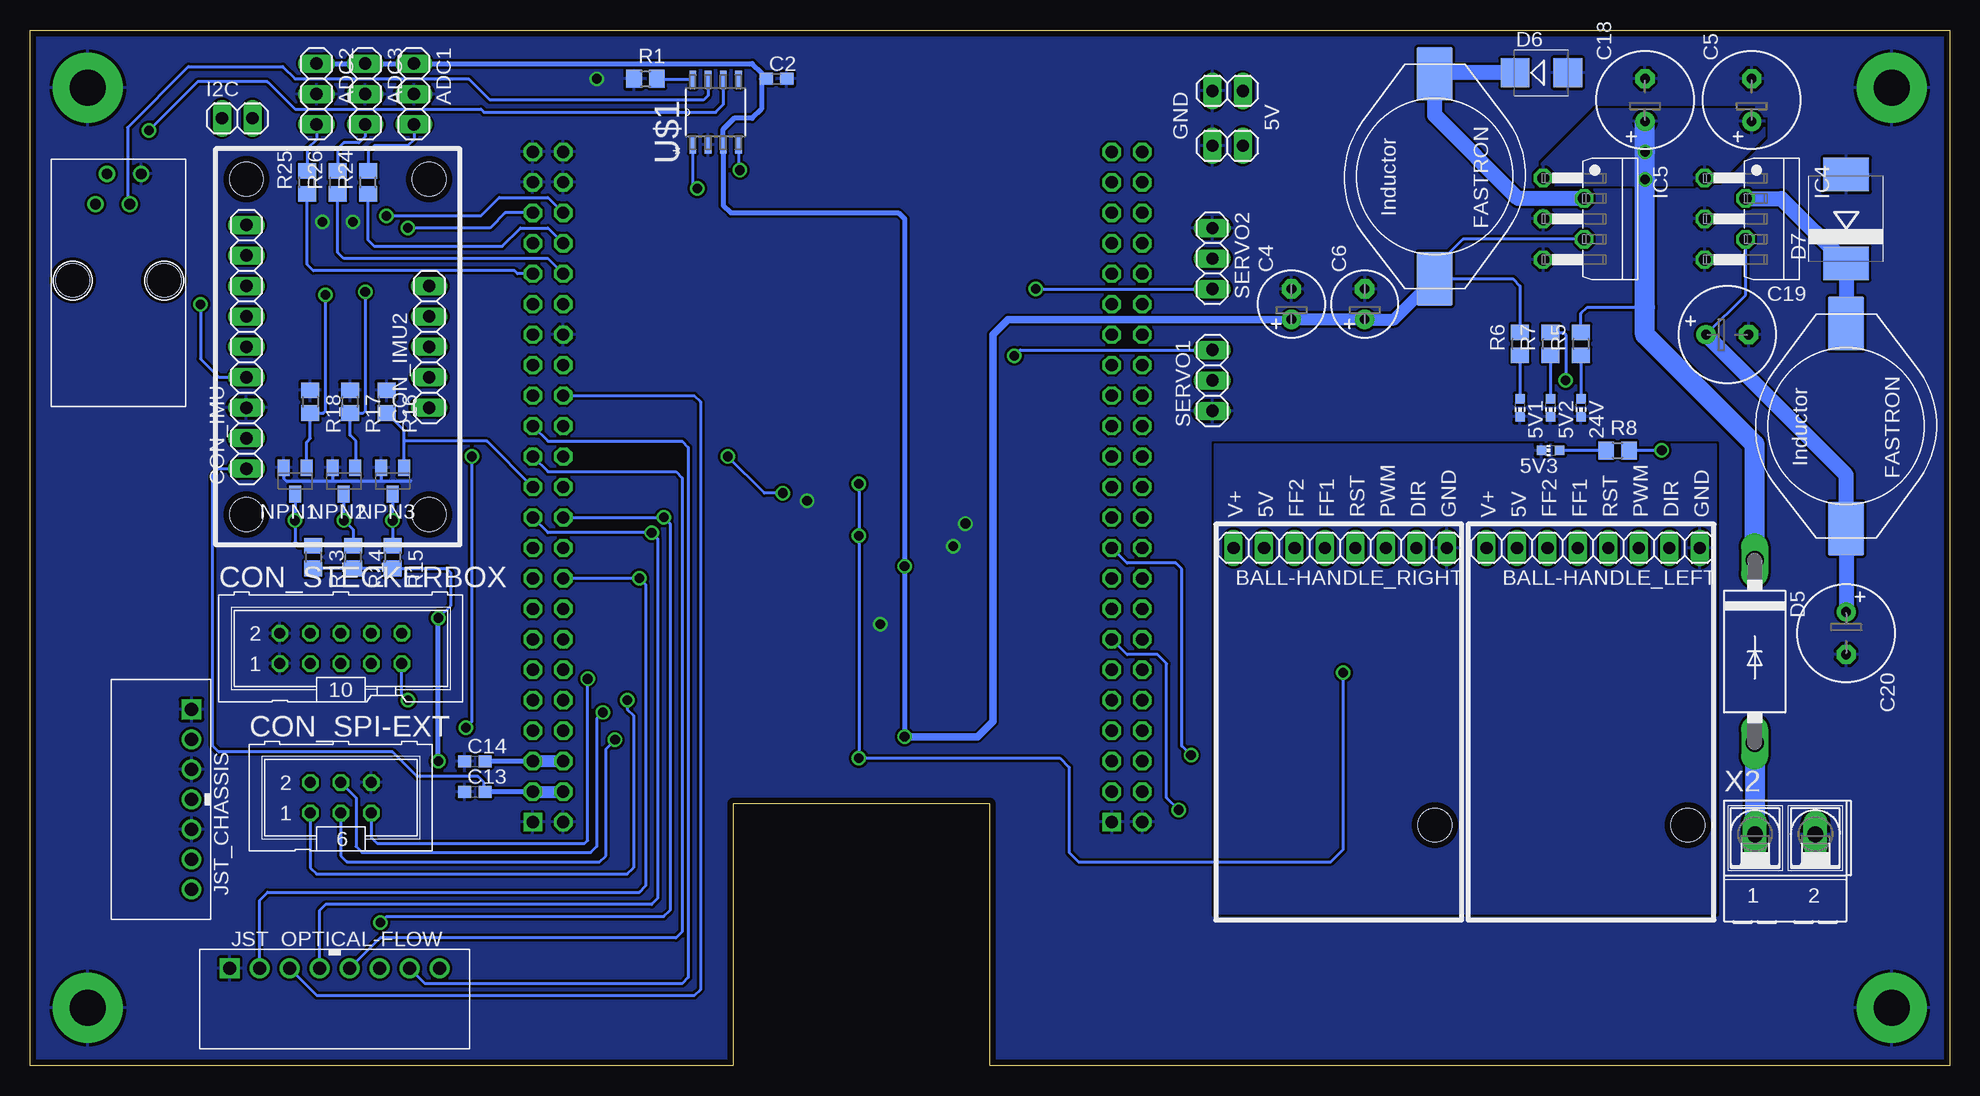
[diagram p6: board, bottom side, seen from below]

Size 160.02 x 86.36 mm. Coordinates in mm from the lower left corner, seen from the top.
Outline: 0,0 80.01,0 80.01,21.86 101.41,21.86 101.41,0 160.02,0 160.02,86.36 0,86.36 0,0
Copper layers (1*16): Top 0.035mm / dielectric 1.5mm / Bottom 0.035mm
Design rules "qp_designrules_8mil": minimum track width 8mil, minimum drill 20mil, track to track 8mil, track to pad 8mil, pad to pad 8mil, via to via 8mil, smd to smd 8mil, copper to edge 20mil, drill to drill 20mil, minimum pad ring 8mil, minimum via ring 8mil, stop-mask expansion 2mil, vias tented up to drill 0mil, thermal gap 10mil
Holes 2.8 mm at 126.75,73.91 141.99,73.91 126.75,45.97 141.99,45.97 21.84,20.07 42.93,20.07

### Footprints (pad centres in the part's own frame; a part is rotated, then mirrored left to right if it is on the bottom)
CHIP-LED0603 = smd 0.8 x 0.8: A 0,-0.75; C 0,0.75
1X03 = drill 1.016 long: 1 -2.54,0; 2 0,0; 3 2.54,0
1X08 = drill 1.016 long: 1 -8.89,0; 2 -6.35,0; 3 -3.81,0; 4 -1.27,0; 5 1.27,0; 6 3.81,0; 7 6.35,0; 8 8.89,0
C0603 = smd 1.1 x 1: 1 -0.85,0; 2 0.85,0
E2,5-6 = drill 0.813 pad 1.6: + -1.27,0 | drill 0.813 pad 1.6 octagon: - 1.27,0
E3,5-8 = drill 0.813 pad 1.6: + -1.778,0 | drill 0.813 pad 1.6 octagon: - 1.778,0
RJ10 = drill 0.9: P$1 -1.905,6.55; P$2 -0.953,9.09; P$3 0.953,6.55; P$4 1.905,9.09 | hole 2.8: -3.81,0.2; 3.81,0.2
1X09 = drill 1.016 long: 1 -10.16,0; 2 -7.62,0; 3 -5.08,0; 4 -2.54,0; 5 0,0; 6 2.54,0; 7 5.08,0; 8 7.62,0; 9 10.16,0
1X05 = drill 1.016 long: 1 -5.08,0; 2 -2.54,0; 3 0,0; 4 2.54,0; 5 5.08,0
ML6 = drill 0.914 octagon: 1 -2.54,-1.27; 2 -2.54,1.27; 3 0,-1.27; 4 0,1.27; 5 2.54,-1.27; 6 2.54,1.27
ML10 = drill 0.914 octagon: 1 -5.08,-1.27; 2 -5.08,1.27; 3 -2.54,-1.27; 4 -2.54,1.27; 5 0,-1.27; 6 0,1.27; 7 2.54,-1.27; 8 2.54,1.27; 9 5.08,-1.27; 10 5.08,1.27
SOD123 = smd 1.4 x 1.4: A 1.9,0; C -1.9,0
DO27-15 = drill 1.499 long: A 7.62,0; C -7.62,0
SMB = smd 2.4 x 2.4: A 2.2,0; C -2.2,0
SMC = smd 2.8 x 3.8: A 3.7,0; C -3.7,0
3,0-PAD = drill 3 pad 5.842: B3,0 0,0
1X02 = drill 1.016 long: 1 -1.27,0; 2 1.27,0
SOT223 = smd 1.219 x 2.235: 1 -2.311,-3.099; 2 0,-3.099; 3 2.311,-3.099 | smd 3.6 x 2.2: 4 0,3.099
TO220-5_STAGGERED = drill 1.016 octagon: !EN 3.404,-3.404; FB 1.702,0; GND 0,-3.404; IN -3.404,-3.404; OUT -1.702,0
S7B-EH = drill 1.1 square: 1 7.5,0 | drill 1.1: 2 5,0; 3 2.5,0; 4 0,0; 5 -2.5,0; 6 -5,0; 7 -7.5,0
S8B-EH = drill 1.1 square: 1 8.75,0 | drill 1.1: 2 6.25,0; 3 3.75,0; 4 1.25,0; 5 -1.25,0; 6 -3.75,0; 7 -6.25,0; 8 -8.75,0
PISR = smd 4.5 x 3: P$1 -8.55,0; P$2 8.55,0
SOP65P640X120-20N = smd 1.473 x 0.356: 1 -2.921,2.921; 2 -2.921,2.286; 3 -2.921,1.626; 4 -2.921,0.965; 5 -2.921,0.33; 6 -2.921,-0.33; 7 -2.921,-0.965; 8 -2.921,-1.626; 9 -2.921,-2.286; 10 -2.921,-2.921; 11 2.921,-2.921; 12 2.921,-2.286; 13 2.921,-1.626; 14 2.921,-0.965; 15 2.921,-0.33; 16 2.921,0.33; 17 2.921,0.965; 18 2.921,1.626; 19 2.921,2.286; 20 2.921,2.921
SOT23-BEC = smd 1 x 1.4: B -0.95,-1.1; C 0,1.1; E 0.95,-1.1
2X23 = drill 1.016 square: 1 -26.67,-1.27 | drill 1.016 octagon: 2 -26.67,1.27; 3 -24.13,-1.27; 4 -24.13,1.27; 5 -21.59,-1.27; 6 -21.59,1.27; 7 -19.05,-1.27; 8 -19.05,1.27; 9 -16.51,-1.27; 10 -16.51,1.27; 11 -13.97,-1.27; 12 -13.97,1.27; 13 -11.43,-1.27; 14 -11.43,1.27; 15 -8.89,-1.27; 16 -8.89,1.27; 17 -6.35,-1.27; 18 -6.35,1.27; 19 -3.81,-1.27; 20 -3.81,1.27; 21 -1.27,-1.27; 22 -1.27,1.27; 23 1.27,-1.27; 24 1.27,1.27; 25 3.81,-1.27; 26 3.81,1.27; 27 6.35,-1.27; 28 6.35,1.27; 29 8.89,-1.27; 30 8.89,1.27; 31 11.43,-1.27; 32 11.43,1.27; 33 13.97,-1.27; 34 13.97,1.27; 35 16.51,-1.27; 36 16.51,1.27; 37 19.05,-1.27; 38 19.05,1.27; 39 21.59,-1.27; 40 21.59,1.27; 41 24.13,-1.27; 42 24.13,1.27; 43 26.67,-1.27; 44 26.67,1.27; 45 29.21,-1.27; 46 29.21,1.27
R0805 = smd 1.3 x 1.5: 1 -0.95,0; 2 0.95,0
SJ = smd 1.168 x 1.6: 1 -0.762,0; 2 0.762,0
SOIC127P600X175-8N = smd 1.981 x 0.559: 1 -2.464,1.905; 2 -2.464,0.635; 3 -2.464,-0.635; 4 -2.464,-1.905; 5 2.464,-1.905; 6 2.464,-0.635; 7 2.464,0.635; 8 2.464,1.905
SOIC127P1032X265-16N = smd 1.981 x 0.559: 1 -4.699,4.445; 2 -4.699,3.175; 3 -4.699,1.905; 4 -4.699,0.635; 5 -4.699,-0.635; 6 -4.699,-1.905; 7 -4.699,-3.175; 8 -4.699,-4.445; 9 4.699,-4.445; 10 4.699,-3.175; 11 4.699,-1.905; 12 4.699,-0.635; 13 4.699,0.635; 14 4.699,1.905; 15 4.699,3.175; 16 4.699,4.445
SOIC127P600X175-8N' = smd 1.473 x 0.559: 1 -2.718,1.905; 2 -2.718,0.635; 3 -2.718,-0.635; 4 -2.718,-1.905; 5 2.718,-1.905; 6 2.718,-0.635; 7 2.718,0.635; 8 2.718,1.905
AK500/2-H = drill 1.321 long: 1 -2.515,0; 2 2.515,0

### Placement (x,y rotation side)
5V1  35.81,54.86 180 bottom
5V2  33.27,54.86 180 bottom
5V3  33.27,51.31 90 bottom
24V  30.73,54.86 180 bottom
ADC1  128.02,81.03 270 bottom
ADC2  136.14,81.03 270 bottom
ADC3  132.08,81.03 270 bottom
BALL-HANDLE_LEFT  29.72,43.18 180 bottom
BALL-HANDLE_RIGHT  50.8,43.18 180 bottom
C1  140.21,39.88 0 top
C2  97.79,82.3 0 bottom
C3  56.39,57.91 90 top
C4  54.86,63.5 90 bottom
C5  16.51,80.52 90 bottom
C6  48.77,63.5 90 bottom
C7  90.93,52.07 90 top
C8  87.12,38.86 270 top
C9  39.88,32.26 270 top
C10  40.64,37.34 90 top
C11  29.46,30.23 90 top
C13  122.94,22.86 0 bottom
C14  122.94,25.4 0 bottom
C16  41.91,47.75 90 top
C17  44.2,49.78 270 top
C18  25.4,80.52 90 bottom
C19  18.54,60.96 0 bottom
C20  8.64,36.07 270 bottom
CAN  152.65,65.28 0 bottom
CON_IMU  141.99,59.94 90 bottom
CON_IMU2  126.75,59.94 90 bottom
CON_SPI-EXT  134.11,22.35 0 bottom
CON_STECKERBOX  134.11,34.8 0 bottom
D4  39.37,49.02 90 top
D5  16.26,34.54 270 bottom
D6  34.04,82.8 0 bottom
D7  8.64,70.61 90 bottom
D8  51.05,48.51 270 top
D9  48.51,48.51 270 top
H1  155.19,4.83 0 top
H2  4.83,81.53 0 top
H3  155.19,81.53 0 top
H4  4.83,4.83 0 top
I2C  142.75,78.99 0 bottom
IC3  32.51,48.77 90 top
IC4  17.02,70.61 270 bottom
IC5  30.48,70.61 270 bottom
JP3  60.2,76.71 180 bottom
JP4  60.2,81.28 180 bottom
JST_CHASSIS  146.56,22.22 90 bottom
JST_OPTICAL-FLOW  134.62,8.13 180 bottom
L1  42.93,74.17 270 bottom
L2  8.64,53.34 270 bottom
LS_SPI  89.92,46.48 180 top
NPN1  137.92,48.77 180 bottom
NPN2  133.86,48.77 180 bottom
NPN3  129.79,48.77 180 bottom
NPN4  151.13,25.65 180 top
P8  68.58,46.99 90 top
P9  116.84,46.99 90 top
PNP1  135.38,39.88 180 top
PNP2  131.57,39.88 180 top
PNP3  127.76,39.88 180 top
PNP4  151.13,18.29 180 top
R1  108.71,82.3 0 bottom
R2  157.48,73.41 90 top
R3  152.15,30.73 270 top
R4  151.13,21.84 180 top
R5  30.73,60.2 90 bottom
R6  35.81,60.2 90 bottom
R7  33.27,60.2 90 bottom
R8  27.69,51.31 0 bottom
R9  150.11,14.73 180 top
R13  136.4,42.42 270 bottom
R14  133.1,42.42 270 bottom
R15  129.79,42.42 270 bottom
R16  130.3,55.37 270 bottom
R17  133.35,55.37 270 bottom
R18  136.65,55.37 270 bottom
R19  111,71.12 0 top
R20  111,68.58 0 top
R21  111,63.5 0 top
R22  111,66.04 0 top
R23  121.16,56.39 270 top
R24  131.83,73.66 90 bottom
R25  136.91,73.66 90 bottom
R26  134.37,73.66 90 bottom
R27  147.07,57.4 0 top
R28  147.07,59.94 0 top
R29  145.8,67.56 90 top
R30  138.43,63.75 90 top
SERVO1  61.47,57.15 90 bottom
SERVO2  61.47,67.31 270 bottom
SJ1  147.07,81.53 90 top
SJ2  156.72,69.09 180 top
U1  56.9,33.78 270 top
U2  47.75,31.75 90 top
U3  36.07,33.78 270 top
U4  26.67,31.75 90 top
U$1  MCP2551-I/SN  [SOIC127P600X175-8N']  102.87,79.5 90 bottom
X2  13.72,19.3 0 bottom

### Tracks (layer width: path | path; a pad name or v marks a point on that pad's centre or on a via)
!BH_L_RESET
  Top 0.254: U4.12 27.3,38.99 28.45,40.13 BALL-HANDLE_LEFT.4
!BH_L_RESET_3V
  Top 0.254: U4.5 27.3,25.53 27.69,25.15 44.96,25.15 48.26,21.84 62.74,21.84 65.79,24.89 65.79,26.42 P8.8
!BH_R_RESET
  Top 0.254: U2.12 48.39,38.99 49.53,40.13 BALL-HANDLE_RIGHT.4
!BH_R_RESET_3V
  Top 0.254: P8.10 66.04,30.48 60.71,25.15 49.53,25.15 48.39,26.29 U2.5
+3V3  (via drill 0.8)
  Top 0.254: 39.88,33.27 38.1,33.27 37.97,33.15 U3.8 | U1.8 58.8,33.15 58.67,33.27 51.05,33.27 v50.55,32.77 50.04,33.27 39.88,33.27 | P9.4 106.93,22.86 106.43,23.37 106.43,25.15 105.92,25.65 v90.93,25.65 | LS_SPI.2 v90.93,44.2 | C7.1 v90.93,48.51 90.93,49.4 LS_SPI.10 | CON_IMU.1 147.57,49.78 148.02,50.23 R27.2 R28.2 | C9.1 39.88,33.27
  Top 1.016: P9.4 P9.3
  Bottom 0.254: v90.93,48.51 v90.93,44.2 v90.93,25.65 74.17,25.65 73.41,24.89 73.41,17.78 72.64,17.02 51.56,17.02 50.55,18.03 v50.55,32.77 | C13.2 122.17,22.95 122.17,23.62 122.68,24.13 127.76,24.13 129.79,26.16 144.27,26.16 144.78,26.67 144.78,49.28 144.27,49.78 CON_IMU.1
  Bottom 0.406: P9.3 C13.2
  Bottom 1.016: P9.3 P9.4
+5V/1  (via drill 0.8)
  Top 0.254: PNP1.E 134.43,39.94 | 134.43,39.94 134.37,39.88 130.56,39.88 | 130.56,39.88 126.75,39.88 | PNP3.E 126.81,39.94 126.75,39.88 | R4.2 PNP4.E 148.93,19.39 148.08,18.54 145.03,18.54 | 145.03,18.54 145.03,16.24 JST_CHASSIS.7 | CON_SPI-EXT.2 139.95,23.62 145.03,18.54 | JST_OPTICAL-FLOW.8 125.87,25.29 v125.98,25.4 | LS_SPI.19 87.88,44.2 88.14,43.94 88.14,42.67 v87.12,41.66 C8.1 | 126.75,39.88 125.98,39.12 v125.98,37.34 | PNP2.E 130.62,39.94 130.56,39.88 | C1.1 134.43,39.88 134.43,39.94
  Top 0.406: P9.5 v125.98,25.4 136.14,25.4 136.65,24.89 CON_SPI-EXT.2
  Top 0.61: v87.12,27.43 107.44,27.43 109.47,25.4 P9.6
  Top 1.016: P9.6 P9.5
  Bottom 0.254: R13.2 R14.2 R15.2 125.29,41.47 124.97,41.15 124.97,38.35 v125.98,37.34 | IC5.FB 40.56,68.91 42.93,66.55 L1.P$2 36.41,65.62 35.81,65.02 R6.2 | C2.1 99.06,82.3
  Bottom 0.406: P9.5 C14.2 | ADC2.1 ADC3.1 ADC1.1 99.82,83.57 99.06,82.8 99.06,82.3 99.06,79.76 99.82,78.99 101.35,78.99 102.23,78.11 U$1.3 102.23,71.75 101.6,71.12 87.63,71.12 87.12,70.61 v87.12,41.66 v87.12,27.43 | v125.98,25.4 v125.98,37.34
  Bottom 0.61: v87.12,27.43 81.03,27.43 79.76,28.7 79.76,60.96 78.49,62.23 C4.+
  Bottom 1.016: P9.6 P9.5 | L1.P$2 46.31,62.23 C6.+ C4.+
  Bottom 1.27: L1.P$2 43.01,65.53
+5V/2  (via drill 0.8)
  Top 0.254: C3.1 57.57,57.06 57.66,57.15 | C20.+ 14.48,32 21.84,32 22.23,31.62 22.23,29.46 | 22.23,29.46 U4.1 | U2.1 34.67,27.05 32.26,29.46 29.46,29.46 | 29.46,29.46 22.23,29.46 | C11.1 29.46,29.46
  Top 0.406: SJ1.2 147.07,84.33 146.56,84.84 59.44,84.84 58.93,84.33 JP4.1
  Top 0.61: SERVO2.2 58.93,67.31 | JP4.1 JP3.1 58.93,67.31 | 58.93,67.31 58.93,57.15
  Top 1.27: SERVO1.2 58.93,57.15 57.66,57.15 v32,57.15 24.13,57.15 C19.+
  Bottom 0.254: C19.+ 17.02,64.26 IC4.FB | R7.2 32.19,61.15 32,60.96 v32,57.15
  Bottom 1.27: C20.+ L2.P$2 8.64,49.28 C19.+
+5V/3  (via drill 0.8)
  Top 0.254: 39.37,51.08 IC3.3 32.23,51.08 32,51.31 v24,51.31 22.61,51.31 22.1,50.8 22.1,39.12 22.23,38.99 U4.16 22.23,34.92 22.86,34.29 37.34,34.29 37.97,34.92 U3.1 40.4,36.25 C10.1 40.68,36.45 U2.16 43.31,34.92 43.94,34.29 58.42,34.29 58.8,34.67 U1.1 | 39.37,51.08 43.75,51.08 C17.1 | D4.A 39.37,51.08
  Bottom 0.254: v24,51.31 R8.2
+24V  (via drill 0.8)
  Bottom 0.254: R5.2 30.73,62.74 30.23,63.25 25.4,63.25
  Bottom 1.676: D5.C 16.26,51.82 25.4,60.96 25.4,63.25 v25.4,73.91 v25.4,76.2 C18.+
  pour Bottom: 15.49,78.99 15.49,77.47 19.56,73.41 34.54,73.41 34.54,74.68 29.46,79.76 16.26,79.76
  pour Top: 15.49,78.99 15.49,77.47 19.56,73.41 34.54,73.41 34.54,74.68 29.46,79.76 16.26,79.76
+24V/3
  Top 0.254: D8.C D9.C 46.35,50.41 45.97,50.04 45.97,46.74 45.72,46.48 41.91,46.48 | 41.91,46.48 39.37,46.48 | 39.37,46.48 35.64,46.48 IC3.1 | D4.C 39.37,46.48 | C16.1 41.91,46.48
ADC0_1.8V
  Top 0.254: R19.2 113.03,71.12 114.3,69.85 116.84,69.85 P9.39 119.89,66.8 119.89,59.69 121.16,58.42 R23.1
ADC1
  Bottom 0.254: ADC1.3 128.02,77.22 128.52,76.71 131.32,76.71 131.83,76.2 R24.2
ADC1_1.8V
  Top 0.254: R20.2 P9.40
  Bottom 0.254: P9.40 116.84,69.85 119.13,69.85 120.65,68.33 131.32,68.33 131.83,68.83 R24.1
ADC2
  Bottom 0.254: ADC2.3 136.14,77.22 136.91,76.45 R25.2
ADC2_1.8V
  Top 0.254: P9.37 116.84,64.77 114.3,64.77 113.03,63.5 R21.2
  Bottom 0.254: P9.37 119.38,66.04 119.63,66.29 136.4,66.29 136.91,66.8 R25.1
ADC3
  Bottom 0.254: ADC3.3 132.08,77.47 132.59,76.96 133.86,76.96 134.37,76.45 R26.2
ADC3_1.8V
  Top 0.254: R22.2 P9.38
  Bottom 0.254: P9.38 116.84,67.31 133.86,67.31 134.37,67.82 R26.1
BH_L_DIR
  Top 0.254: U4.14 24.77,38.99 23.37,40.39 BALL-HANDLE_LEFT.2
BH_L_DIR_3V
  Top 0.254: P8.7 68.58,26.67 68.58,24.64 68.07,24.13 66.29,24.13 65.79,23.62 65.79,20.32 65.28,19.81 47.24,19.81 43.94,23.11 25.4,23.11 24.77,23.75 U4.3
BH_L_FF1
  Top 0.254: U3.3 35.43,37.97 35.05,38.35 31.5,38.35 30.99,38.86 BALL-HANDLE_LEFT.5
BH_L_FF1_3V
  Top 0.254: U3.6 35.43,29.08 36.07,28.45 40.39,28.45 41.66,29.72 52.32,29.72 55.37,26.67 60.71,26.67 67.06,33.02 P8.12
BH_L_FF2
  Top 0.254: U3.2 36.7,39.24 36.32,39.62 34.04,39.62 33.53,40.13 BALL-HANDLE_LEFT.6
BH_L_FF2_3V
  Top 0.254: U3.7 36.7,29.84 37.08,29.46 39.88,29.46 41.15,30.73 52.83,30.73 55.88,27.69 60.2,27.69 65.53,33.02 65.53,35.05 66.04,35.56 P8.14
BH_L_PWM
  Top 0.254: U4.13 26.04,39.5 25.91,39.62 BALL-HANDLE_LEFT.3
BH_L_PWM_3V  (via drill 0.8)
  Top 0.254: v64.26,21.34 63.75,20.83 47.75,20.83 44.45,24.13 26.67,24.13 26.04,24.77 U4.4
  Bottom 0.254: P8.13 68.58,34.29 66.04,34.29 65.28,33.53 65.28,22.35 v64.26,21.34
BH_R_DIR
  Top 0.254: U2.14 45.85,38.99 44.45,40.39 BALL-HANDLE_RIGHT.2
BH_R_DIR_3V
  Top 0.254: P8.9 68.58,29.21 66.8,29.21 64.77,27.18 64.77,25.4 62.23,22.86 48.77,22.86 45.85,25.78 U2.3
BH_R_FF1
  Top 0.254: U1.3 56.26,37.97 55.88,38.35 52.58,38.35 52.07,38.86 BALL-HANDLE_RIGHT.5
BH_R_FF1_3V
  Top 0.254: U1.6 56.26,29.08 56.64,28.7 59.69,28.7 64.52,33.53 64.52,37.59 65.02,38.1 P8.16
BH_R_FF2
  Top 0.254: U1.2 57.53,38.99 56.9,39.62 55.12,39.62 54.61,40.13 BALL-HANDLE_RIGHT.6
BH_R_FF2_3V
  Top 0.254: U1.7 57.53,30.1 57.91,29.72 59.18,29.72 63.5,34.04 63.5,40.13 64.01,40.64 P8.18
BH_R_PWM
  Top 0.254: U2.13 47.12,40.01 46.99,40.13 BALL-HANDLE_RIGHT.3
BH_R_PWM_3V  (via drill 0.8)
  Top 0.254: v63.25,25.91 61.72,24.38 48.77,24.38 47.12,26.04 U2.4
  Bottom 0.254: v63.25,25.91 64.01,26.67 64.01,41.4 64.52,41.91 68.58,41.91 P8.19
CAN_RX  (via drill 0.8)
  Top 0.254: LS_SPI.12 85.34,48.77 84.84,49.28 84.84,73.91 85.34,74.42 100.58,74.42 v100.84,74.68
  Bottom 0.254: U$1.4 100.97,74.8 v100.84,74.68
CAN_RX_3V
  Top 0.254: P9.24 100.58,48.26 100.08,48.77 LS_SPI.9
CAN_TX  (via drill 0.8)
  Top 0.254: v104.39,73.15 89.41,73.15 88.9,72.64 88.9,48.51 88.49,48.11 LS_SPI.13
  Bottom 0.254: U$1.1 104.78,73.53 v104.39,73.15
CAN_TX_3V  (via drill 0.8)
  Top 0.254: v101.85,50.8 P9.26 | LS_SPI.8 96.93,48.11 v97.28,47.75
  Bottom 0.254: v97.28,47.75 98.81,47.75 v101.85,50.8
CANH
  Top 0.254: SJ2.2 154.44,69.09 CAN.P$3
  Bottom 0.254: U$1.7 103.5,80.9 103.89,80.52 121.67,80.52 123.44,82.3 137.92,82.3 138.94,83.31 146.81,83.31 151.89,78.23 151.89,72.02 CAN.P$3
CANL  (via drill 0.8)
  Top 0.254: R2.2 153.62,74.36 CAN.P$2 150.11,77.86 v150.11,77.98
  Bottom 0.254: U$1.6 102.23,80.14 102.87,79.5 122.17,79.5 122.43,79.76 137.92,79.76 140.21,82.04 146.05,82.04 v150.11,77.98
DRDY
  Top 0.254: P8.15 73.41,38.1 73.91,38.61 73.91,78.49 74.42,78.99 121.41,78.99 121.92,78.49 121.92,62.23 124.21,59.94 CON_IMU2.3
GND  (via drill 0.8)
  Bottom 0.254: NPN1.E 138.87,48.96 138.68,48.77 134.87,48.77 | 134.87,48.77 130.81,48.77 | 130.81,48.77 128.27,48.77 | NPN3.E 130.74,48.83 130.81,48.77 | NPN2.E 134.81,48.83 134.87,48.77
  other vias: 82.04,45.21 95.25,47.12 89.15,36.83 83.06,43.31 133.1,70.36 135.64,70.36 112.78,82.3
  pour Top (rank 6): 0,86.36 160.02,86.36 160.02,0 0,0
  pour Bottom (rank 6): 0,86.36 160.02,86.36 160.02,0 0,0
GND3
  pour Top (rank 2): 19.56,51.82 19.56,34.54 61.21,34.54 61.21,51.82
  pour Bottom: 19.56,51.82 19.56,12.7 61.21,12.7 61.21,51.82
I2C2_SCL  (via drill 0.8)
  Top 0.254: P9.19 119.38,43.18 125.48,49.28 137.92,49.28 138.43,49.78 138.43,56.64 139.19,57.4 CON_IMU.4 R27.1 | R29.1 v145.8,63.5
  Bottom 0.254: v145.8,63.5 145.8,58.93 144.27,57.4 CON_IMU.4
I2C2_SDA
  Top 0.254: P9.20 116.84,44.45 119.38,44.45 124.97,50.04 137.16,50.04 137.67,50.55 137.67,59.18 138.43,59.94 | 138.43,59.94 CON_IMU.5 R28.1 | 138.43,59.94 R30.1
INT1
  Top 0.254: CON_IMU2.4 123.44,62.48 122.94,62.99 122.94,79.5 122.43,80.01 73.41,80.01 72.9,79.5 72.9,41.15 72.39,40.64 P8.17
INT2
  Top 0.254: P8.26 68.58,52.07 71.37,52.07 71.88,52.58 71.88,80.52 72.39,81.03 123.44,81.03 123.95,80.52 123.95,65.53 124.46,65.02 CON_IMU2.5
INTG
  Top 0.254: CON_IMU2.2 124.21,57.4 120.9,60.71 120.9,77.47 120.4,77.98 75.44,77.98 74.93,77.47 74.93,33.53 74.42,33.02 P8.11
LB_ADC  (via drill 0.8)
  Top 0.254: v123.19,50.8 123.19,54.86 122.68,55.37 121.22,55.37 R23.2 | JST_CHASSIS.4 143.64,22.22 143,22.86 143,27.69 142.49,28.19 v123.7,28.19
  Bottom 0.254: v123.19,50.8 123.19,28.7 v123.7,28.19
N$1  (via drill 0.8)
  Top 0.254: PNP1.B 136.33,43.88 v137.92,45.47
  Bottom 0.254: NPN1.C v137.92,45.47 137.92,43.69 137.6,43.37 R13.1
N$2  (via drill 0.8)
  Top 0.254: PNP2.B 132.52,44.13 v133.86,45.47
  Bottom 0.254: NPN2.C 133.86,45.72 v133.86,45.47 133.1,44.7 R14.1
N$3
  Top 0.254: NPN4.C 152.08,23.6 R4.1 PNP4.B
N$4  (via drill 0.8)
  Top 0.254: PNP3.B 128.71,42.29 R15.1 v129.79,45.47
  Bottom 0.254: NPN3.C 129.79,46.48 v129.79,45.47 R15.1
N$5
  Top 1.676: D5.A 16.26,19.33 X2.1
  Bottom 1.676: D5.A 16.26,19.3
N$6
  Bottom 0.254: R5.1 24V.A
N$7
  Bottom 0.254: R6.1 5V1.A
N$8
  Bottom 0.254: R7.1 5V2.A
N$9
  Bottom 0.254: U$1.8 107.69,82.22 R1.2
N$10
  Top 0.254: R2.1 SJ2.1
N$11
  Bottom 1.27: D6.C 42.84,82.8 L1.P$1 42.93,79.25 35.99,72.31 IC5.OUT
N$12
  Bottom 1.27: L2.P$1 D7.C 14.04,72.31 IC4.OUT
N$13
  Top 0.254: BALL-HANDLE_LEFT.8 38.61,45.21 38.86,45.47 46.23,45.47 47.38,46.61 D9.A
N$14
  Top 0.254: D8.A 59.3,46.61 59.69,46.23 BALL-HANDLE_RIGHT.8
N$15
  Bottom 0.254: R8.1 5V3.A
N$16
  Top 0.254: R9.2 149.04,14.73 JST_CHASSIS.6
N$17
  Top 0.254: I2C.1 145.03,77.98 145.03,70.61 145.8,69.85 R29.2
N$18
  Top 0.254: I2C.2 138.43,75.95 R30.2
N$19
  Top 0.254: SJ1.1 147.07,79.5 150.62,75.95 150.88,75.95 152.4,74.42 152.4,73.99 CAN.P$1
OF_LED
  Top 0.254: PNP4.C 151.13,14.8 R9.1
OF_LED_3V
  Top 0.254: P9.12 116.84,31.75 149.35,31.75 149.86,31.24 149.86,30.23 150.3,29.78 R3.2 152.08,29.72 NPN4.B
OF_NCS_3V
  Bottom 0.254: P9.30 104.65,55.88 104.14,55.37 104.14,6.35 104.65,5.84 136.08,5.84 JST_OPTICAL-FLOW.3
OF_NPD_3V
  Bottom 0.254: P9.25 116.84,49.53 106.17,49.53 105.66,49.02 105.66,11.18 106.17,10.67 130.83,10.67 JST_OPTICAL-FLOW.5
OF_RST_3V
  Bottom 0.254: P9.27 116.84,52.07 105.66,52.07 105.16,51.56 105.16,7.37 105.66,6.86 127.1,6.86 JST_OPTICAL-FLOW.7
SERVO_PWM  (via drill 0.8)
  Top 0.254: LS_SPI.14 78.28,47.45 77.98,47.75 v77.98,59.18
  Bottom 0.254: SERVO1.3 77.47,59.69 v77.98,59.18
SERVO_PWM2  (via drill 0.8)
  Top 0.254: LS_SPI.15 77.14,46.81 76.71,47.24 76.71,64.26 v76.2,64.77
  Bottom 0.254: v76.2,64.77 SERVO2.3
SERVO_PWM2_3V
  Top 0.254: P9.16 105.66,38.1 101.09,42.67 90.42,42.67 89.92,43.18 89.92,46.48 90.25,46.81 LS_SPI.6
SERVO_PWM_3V
  Top 0.254: P9.14 106.93,35.56 100.58,41.91 89.66,41.91 89.15,42.42 89.15,46.99 89.61,47.45 LS_SPI.7
SPI0_CLK  (via drill 0.8)
  Top 0.254: JST_OPTICAL-FLOW.6 130.87,11.88 v130.81,11.94 | LS_SPI.5 106.76,46.15 v107.19,45.72
  Bottom 0.254: P9.22 v107.19,45.72 106.68,45.21 106.68,12.95 107.19,12.45 130.3,12.45 v130.81,11.94
SPI0_CS
  Top 0.254: LS_SPI.1 101.47,43.56 105.66,39.37 116.84,39.37 P9.17
SPI0_D0_MISO  (via drill 0.8)
  Top 0.254: LS_SPI.4 101.8,45.52 102.87,44.45 v108.2,44.45
  Bottom 0.254: JST_OPTICAL-FLOW.4 135.87,12.97 135.38,13.46 108.2,13.46 107.7,13.97 107.7,43.94 v108.2,44.45 116.84,44.45 P9.21
SPI0_D1_MOSI  (via drill 0.8)
  Top 0.254: LS_SPI.3 101.45,44.86 105.66,40.64 v109.22,40.64
  Bottom 0.254: JST_OPTICAL-FLOW.2 140.87,13.82 140.21,14.48 109.22,14.48 108.71,14.99 108.71,40.13 v109.22,40.64 P9.18
SPI_CLK  (via drill 0.8)
  Top 0.254: LS_SPI.16 81.46,46.15 81.03,45.72 81.03,32.26 83.31,29.97 108.46,29.97 v111.25,27.18
  Bottom 0.254: CON_SPI-EXT.3 134.11,17.53 133.6,17.02 112.52,17.02 112.01,17.53 112.01,26.42 v111.25,27.18
SPI_CS  (via drill 0.8)
  Top 0.254: LS_SPI.20 85.22,43.56 84.84,43.18 84.84,33.27 85.34,32.77 113.03,32.77 v113.54,32.26
  Bottom 0.254: CON_SPI-EXT.5 131.57,19.05 131.06,18.54 113.79,18.54 113.54,18.8 v113.54,32.26
SPI_MISO  (via drill 0.8)
  Top 0.254: LS_SPI.17 83.87,45.52 82.04,43.69 82.04,32.77 83.82,30.99 109.73,30.99 v110.24,30.48
  Bottom 0.254: CON_SPI-EXT.1 136.65,16.51 136.14,16 110.24,16 109.73,16.51 109.73,29.21 110.24,29.72 v110.24,30.48
SPI_MOSI  (via drill 0.8)
  Top 0.254: LS_SPI.18 85.24,44.86 84.07,43.69 84.07,33.02 85.09,32 111,32 111.76,31.24 111.76,29.97 v112.27,29.46
  Bottom 0.254: CON_SPI-EXT.4 132.84,22.35 132.84,18.29 132.33,17.78 113.28,17.78 112.78,18.29 112.78,28.96 v112.27,29.46
SW_BUNDLE-LED
  Top 0.254: PNP2.C CON_STECKERBOX.8
SW_BUNDLE-LED_3V  (via drill 0.8)
  Top 0.254: v128.52,69.85 132.08,66.29 v132.08,64.52
  Bottom 0.254: NPN2.B 132.84,49.93 132.84,52.07 133.35,52.58 R17.2 132.27,54.42 132.08,54.61 v132.08,64.52 | P9.41 120.4,71.12 121.67,69.85 v128.52,69.85
SW_BUNDLE_3V
  Top 0.254: P9.13 127.51,35.56 128.27,34.8 130.3,34.8 CON_STECKERBOX.7
SW_POWER-LED
  Top 0.254: PNP3.C 127.76,37.34 CON_STECKERBOX.10
SW_POWER-LED_3V
  Bottom 0.254: NPN3.B 128.84,52.07 | 128.84,52.07 128.84,52.96 R16.2 | P9.23 121.92,52.07 128.84,52.07
SW_PWR_BUT  (via drill 0.8)
  Top 0.254: P9.9 v128.52,30.48
  Bottom 0.254: v128.52,30.48 129.03,30.99 CON_STECKERBOX.9
SW_VISION-LED
  Top 0.254: PNP1.C 135.38,37.34 CON_STECKERBOX.6
SW_VISION-LED_3V  (via drill 0.8)
  Top 0.254: v135.38,64.26 135.38,65.79 v130.3,70.87
  Bottom 0.254: v135.38,64.26 135.38,54.61 135.57,54.42 R18.2 136.65,52.32 136.97,52 NPN1.B | v130.3,70.87 122.43,70.87 120.9,72.39 116.84,72.39 P9.42
SW_VISION_3V
  Top 0.254: P9.11 118.87,32.26 132.84,32.26 CON_STECKERBOX.5

### Text on the board
bNames: 5V | GND | GND | DIR | PWM | RST | FF1 | FF2 | 5V | V+ | GND | DIR | PWM | RST | FF1 | FF2 | 5V | V+